# EAGLE design motherboard_rev1 (EAGLE 6.5.0)
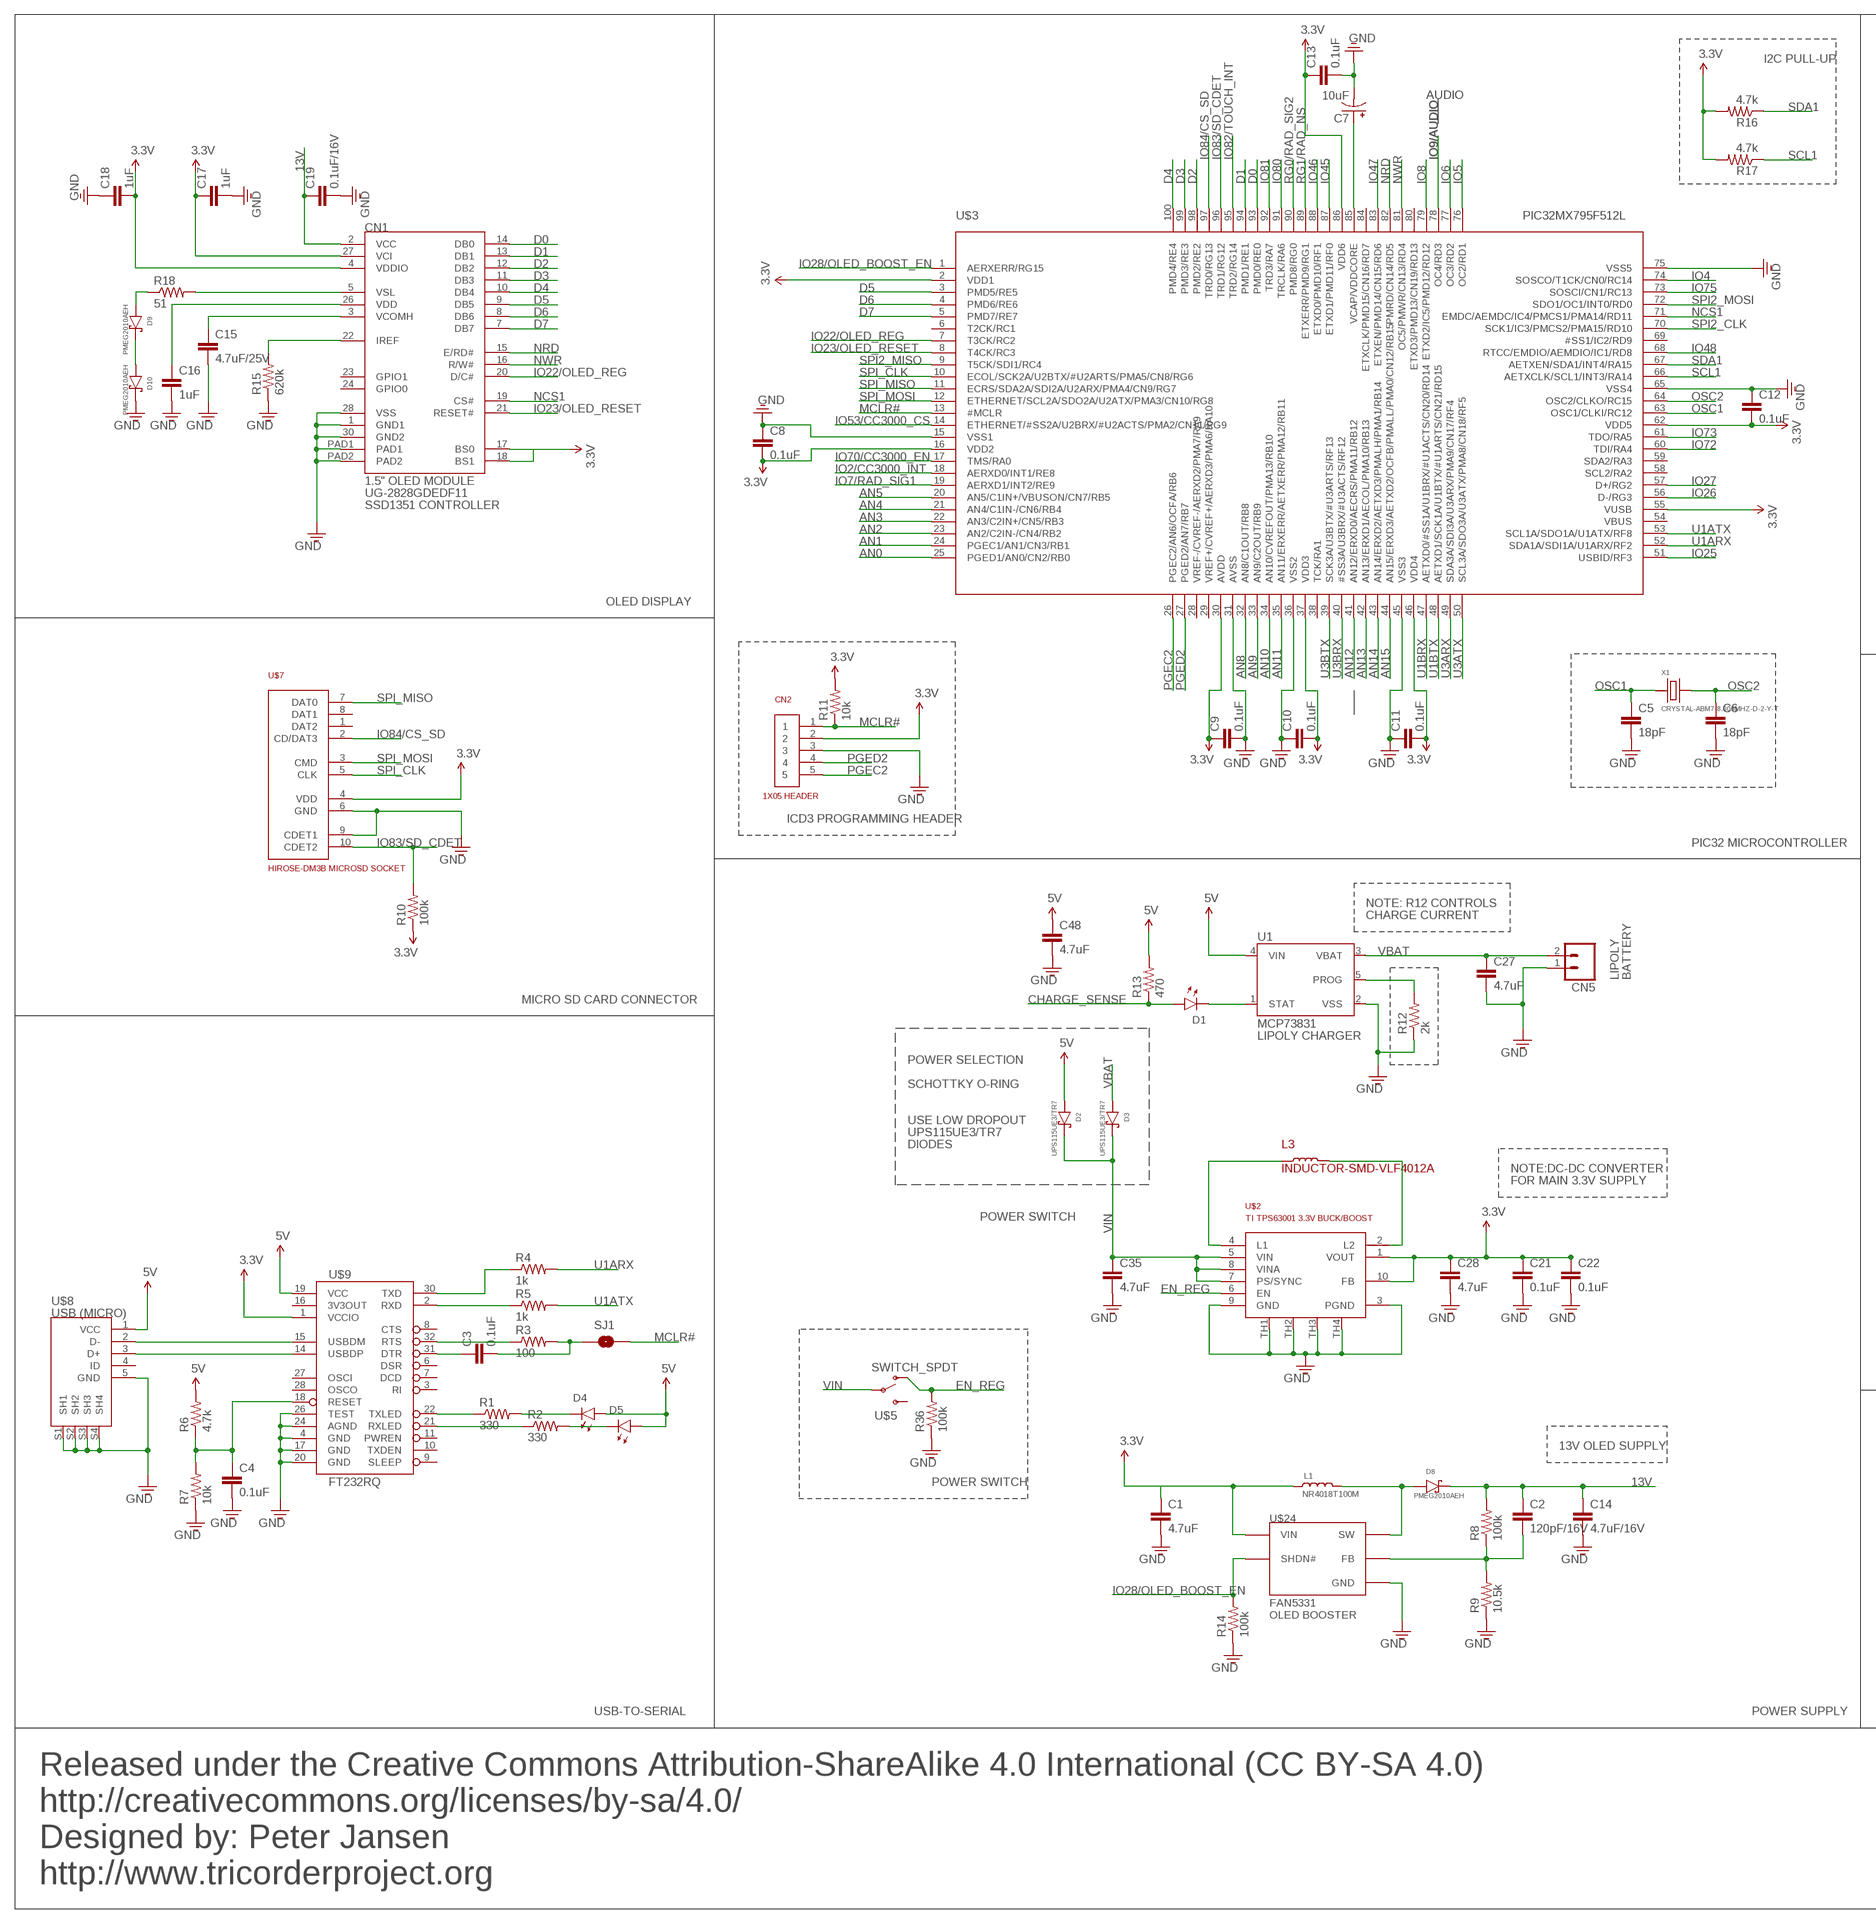
[diagram p0: schematic, sheet 1, part 1 of 2]
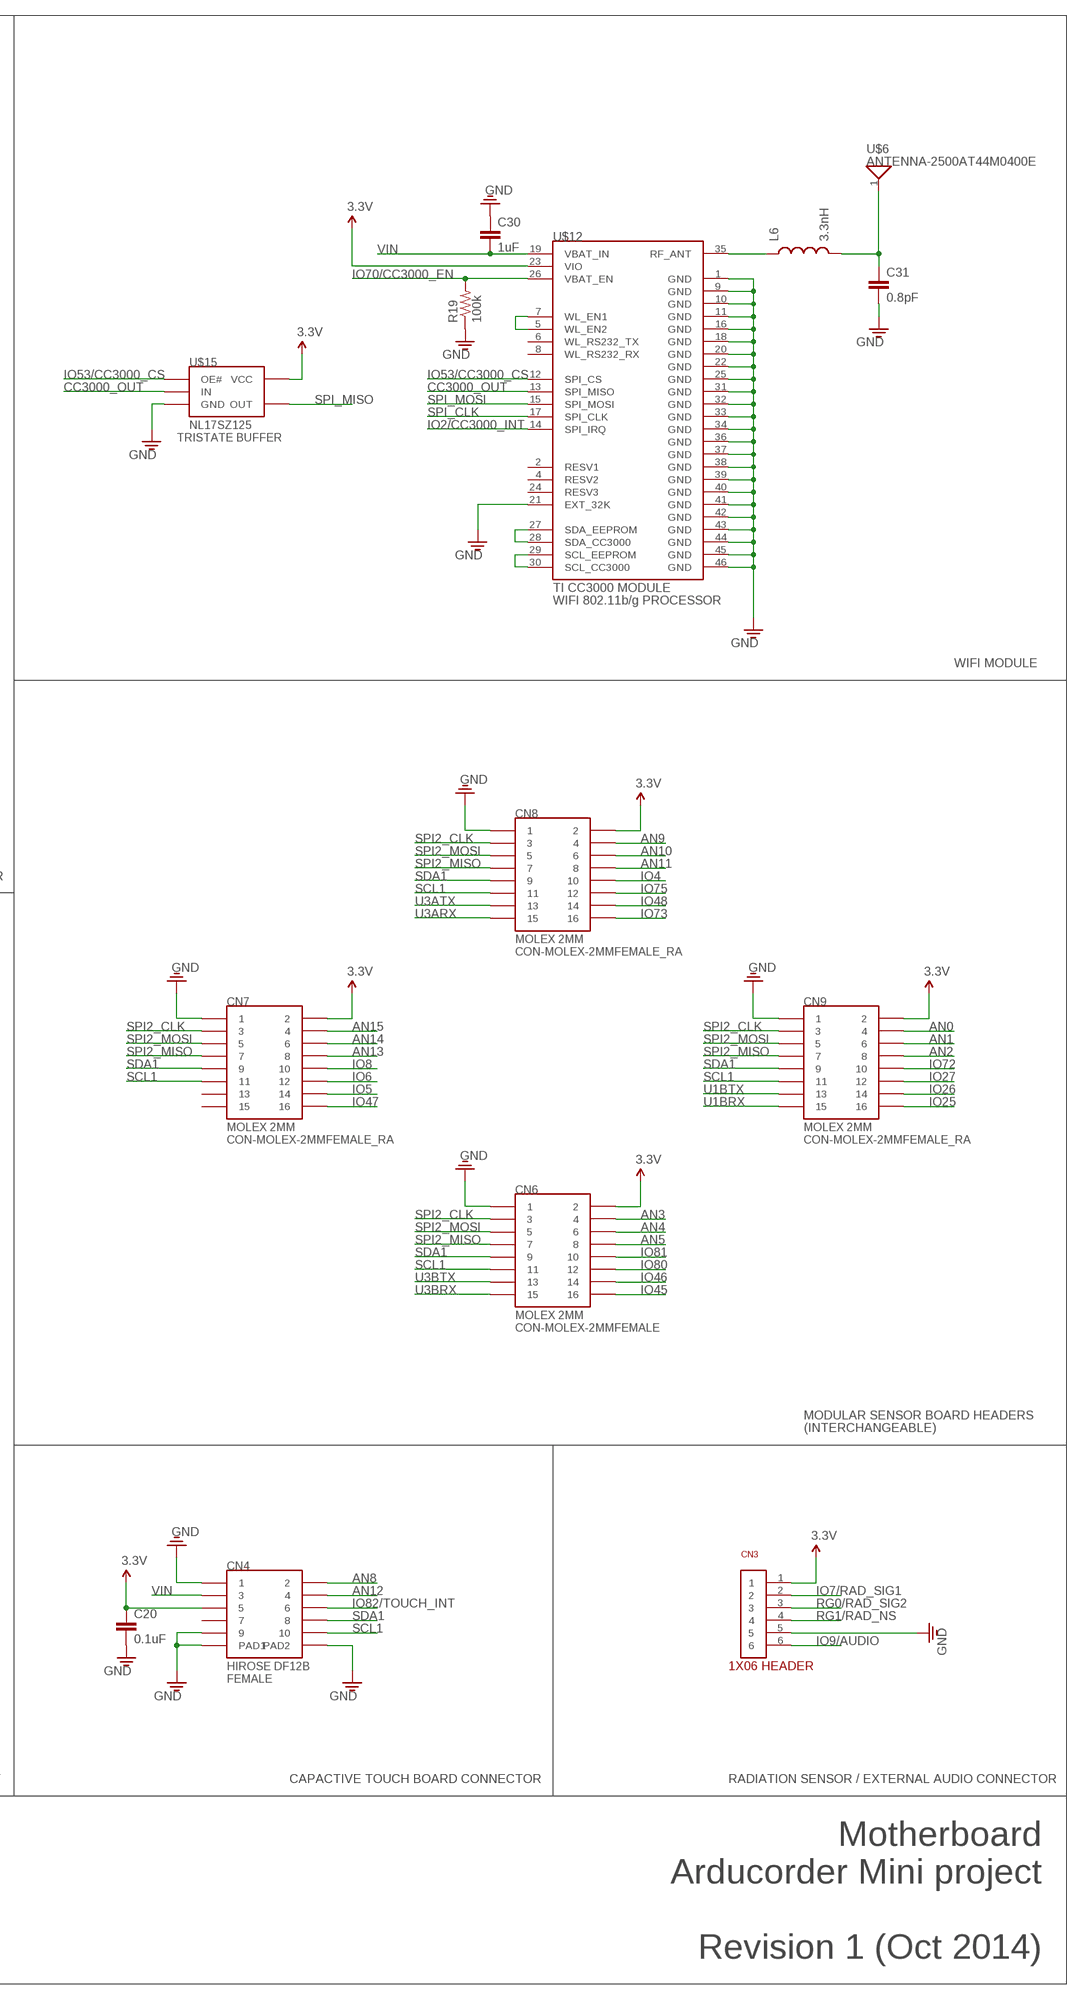
[diagram p1: schematic, sheet 1, part 2 of 2]

## Parts
C1  4.7uF  CAP0603  [0603]
C2  120pF/16V  CAP0603  [0603]
C3  0.1uF  CAP0603  [0603]
C4  0.1uF  CAP0603  [0603]
C5  18pF  CAP0603  [0603]
C6  18pF  CAP0603  [0603]
C7  10uF  CAP_POL1206  [EIA3216]
C8  0.1uF  CAP0603  [0603]
C9  0.1uF  CAP0603  [0603]
C10  0.1uF  CAP0603  [0603]
C11  0.1uF  CAP0603  [0603]
C12  0.1uF  CAP0603  [0603]
C13  0.1uF  CAP0603  [0603]
C14  4.7uF/16V  CAP0603  [0603]
C15  4.7uF/25V  CAP0603  [0603]
C16  1uF  CAP0603  [0603]
C17  1uF  CAP0603  [0603]
C18  1uF  CAP0603  [0603]
C19  0.1uF/16V  CAP0603  [0603]
C20  0.1uF  CAP0603  [0603]
C21  0.1uF  CAP0603  [0603]
C22  0.1uF  CAP0603  [0603]
C27  4.7uF  CAP0603  [0603]
C28  4.7uF  CAP0603  [0603]
C30  1uF  CAP0603  [0603]
C31  0.8pF  CAP0402  [C0402]
C35  4.7uF  CAP0603  [0603]
C48  4.7uF  CAP0603  [0603]
CN1  UG-2828GDEDF11-1.5OLED  [XF2M-3015-1A-1.5LCD]
CN2  1X05  [1X05]
CN3  PHF-106-01-L-S  1X06  [1X06]
CN4  FEMALE  CON-HIROSE-DF12FEMALE  [DF12B(3.0)-10DP-0.5V(86)]
CN5  M02-JST-2MM-SMT  [JST-2-SMD]
CN6  CON-MOLEX-2MMFEMALE  [MOLEX-0791091007]
CN7  CON-MOLEX-2MMFEMALE_RA  [MOLEX-87368-1624]
CN8  CON-MOLEX-2MMFEMALE_RA  [MOLEX-87368-1624]
CN9  CON-MOLEX-2MMFEMALE_RA  [MOLEX-87368-1624]
D1  0605-LED  [0603-LED]
D2  UPS115UE3/TR7  DIODE-SCHOTTKY  [DO-214BA]
D3  UPS115UE3/TR7  DIODE-SCHOTTKY  [DO-214BA]
D4  0605-LED  [0603-LED]
D5  0605-LED  [0603-LED]
D8  PMEG2010AEH  DIODE-SCHOTTKYSOD123F  [SOD123F]
D9  PMEG2010AEH  DIODE-SCHOTTKYSOD123F  [SOD123F]
D10  PMEG2010AEH  DIODE-SCHOTTKYSOD123F  [SOD123F]
L1  NR4018T100M  INDUCTORNR4018T100M  [NR4018T100M]
L3  INDUCTOR-SMD-VLF4012A  [VLF4012A]
L6  3.3nH  INDUCTOR0402  [C0402]
R1  330  RESISTOR0603  [0603]
R2  330  RESISTOR0603  [0603]
R3  100  RESISTOR0603  [0603]
R4  1k  RESISTOR0603  [0603]
R5  1k  RESISTOR0603  [0603]
R6  4.7k  RESISTOR0603  [0603]
R7  10k  RESISTOR0603  [0603]
R8  100k  RESISTOR0603  [0603]
R9  10.5k  RESISTOR0603  [0603]
R10  100k  RESISTOR0603  [0603]
R11  10k  RESISTOR0603  [0603]
R12  2k  RESISTOR0603  [0603]
R13  470  RESISTOR0603  [0603]
R14  100k  RESISTOR0603  [0603]
R15  620k  RESISTOR0603  [0603]
R16  4.7k  RESISTOR0603  [0603]
R17  4.7k  RESISTOR0603  [0603]
R18  51  RESISTOR0603  [0603]
R19  100k  RESISTOR0603  [0603]
R36  100k  RESISTOR0603  [0603]
SJ1  SOLDERJUMPERTRACE  [SJ_2S-TRACE]
U1  MCP73831  [SOT23-5]
U$2  TI-TPS63001-3.3V-BUCKBOOST  [TPS63001]
U$3  PIC32MX795F512L-80I/PF  [SQFP-S-14X14-100]
U$5  SWITCH_SPDT  [KPS-1290]
U$6  ANTENNA-2500AT44M0400E  [ANT-2500AT44M0400E]
U$7  CON-HIROSE-DM3B-MICROSD  [CON-HIROSE-DM3B-MICROSD]
U$8  USB-MICROB  [FCI-10104110-0001LF]
U$9  FT232RQ  [QFN-32]
U$12  CC3000  [CC3000]
U$15  BUFFER-NL17SZ125  [TSOP-5]
U$24  FAN5331-BOOST  [TSOP-5]
X1  CRYSTAL-ABM7-8.000MHZ-D-2-Y-T  [CYRSTAL-6.0X3.5MM]

## Nets
3.3V: C1.1 C8.2 C9.1 C10.2 C11.2 C12.2 C13.1 C17.1 C18.2 C20.1 C21.1 C22.1 C28.1 CN1.4(VDDIO) CN1.17(BS0) CN1.18(BS1) CN1.27(VCI) CN2.2 CN3.1 CN4.5 CN6.2 CN7.2 CN8.2 CN9.2 L1.2 R10.1 R11.2 R16.2 R17.2 U$2.1(VOUT) U$2.10(FB) U$3.2(VDD1) U$3.16(VDD2) U$3.30(AVDD) U$3.37(VDD3) U$3.46(VDD4) U$3.55(VUSB) U$3.62(VDD5) U$3.86(VDD6) U$7.4(VDD) U$9.1(VCCIO) U$12.23(VIO) U$15.5(VCC) U$24.5(VIN)
5V: C48.1 D2.ANODE D4.ANODE D5.ANODE R6.2 R13.2 U1.4(VIN) U$8.1(VCC) U$9.19(VCC)
13V: C2.1 C14.1 C19.1 CN1.2(VCC) D8.1(CATHODE) R8.2
AN0: CN9.4 U$3.25(PGED1/AN0/CN2/RB0)
AN1: CN9.6 U$3.24(PGEC1/AN1/CN3/RB1)
AN2: CN9.8 U$3.23(AN2/C2IN-/CN4/RB2)
AN3: CN6.4 U$3.22(AN3/C2IN+/CN5/RB3)
AN4: CN6.6 U$3.21(AN4/C1IN-/CN6/RB4)
AN5: CN6.8 U$3.20(AN5/C1IN+/VBUSON/CN7/RB5)
AN8: CN4.2 U$3.32(AN8/C1OUT/RB8)
AN9: CN8.4 U$3.33(AN9/C2OUT/RB9)
AN10: CN8.6 U$3.34(AN10/CVREFOUT/PMA13/RB10)
AN11: CN8.8 U$3.35(AN11/ERXERR/AETXERR/PMA12/RB11)
AN12: CN4.4 U$3.41(AN12/ERXD0/AECRS/PMA11/RB12)
AN13: CN7.8 U$3.42(AN13/ERXD1/AECOL/PMA10/RB13)
AN14: CN7.6 U$3.43(AN14/ERXD2/AETXD3/PMALH/PMA1/RB14)
AN15: CN7.4 U$3.44(AN15/ERXD3/AETXD2/OCFB/PMALL/PMA0/CN12/RB15)
CC3000_OUT: U$12.13(SPI_MISO) U$15.2(IN)
CHARGE_SENSE: D1.ANODE R13.1
D0: CN1.14(DB0) U$3.93(PMD0/RE0)
D1: CN1.13(DB1) U$3.94(PMD1/RE1)
D2: CN1.12(DB2) U$3.98(PMD2/RE2)
D3: CN1.11(DB3) U$3.99(PMD3/RE3)
D4: CN1.10(DB4) U$3.100(PMD4/RE4)
D5: CN1.9(DB5) U$3.3(PMD5/RE5)
D6: CN1.8(DB6) U$3.4(PMD6/RE6)
D7: CN1.7(DB7) U$3.5(PMD7/RE7)
EN_REG: R36.2 U$2.6(EN) U$5.O
GND: C1.2 C4.2 C5.2 C6.2 C7.C(-) C8.1 C9.2 C10.1 C11.1 C12.1 C13.2 C14.2 C15.2 C16.2 C17.2 C18.1 C19.2 C20.2 C21.2 C22.2 C27.2 C28.2 C30.1 C31.2 C35.2 C48.2 CN1.1(GND1) CN1.28(VSS) CN1.30(GND2) CN1.PAD1 CN1.PAD2 CN2.3 CN3.5 CN4.1 CN4.9 CN4.PAD1 CN4.PAD2 CN5.1 CN6.1 CN7.1 CN8.1 CN9.1 D10.1(CATHODE) R7.1 R9.1 R12.1 R14.1 R15.1 R19.1 R36.1 U1.2(VSS) U$2.3(PGND) U$2.9(GND) U$2.TH1(THERM1) U$2.TH2(THERM2) U$2.TH3(THERM3) U$2.TH4(THERM4) U$3.15(VSS1) U$3.31(AVSS) U$3.36(VSS2) U$3.45(VSS3) U$3.65(VSS4) U$3.75(VSS5) U$7.6(GND) U$7.9(CDET1) U$8.5(GND) U$8.S1(SH1) U$8.S2(SH2) U$8.S3(SH3) U$8.S4(SH4) U$9.4(GND) U$9.17(GND) U$9.20(GND) U$9.24(AGND) U$9.26(TEST) U$12.1(GND) U$12.9(GND) U$12.10(GND) U$12.11(GND) U$12.16(GND) U$12.18(GND) U$12.20(GND) U$12.21(EXT_32K) U$12.22(GND) U$12.25(GND) U$12.31(GND) U$12.32(GND) U$12.33(GND) U$12.34(GND) U$12.36(GND) U$12.37(GND) U$12.38(GND) U$12.39(GND) U$12.40(GND) U$12.41(GND) U$12.42(GND) U$12.43(GND) U$12.44(GND) U$12.45(GND) U$12.46(GND) U$15.3(GND) U$24.2(GND)
IO2/CC3000_INT: U$3.18(AERXD0/INT1/RE8) U$12.14(SPI_IRQ)
IO4: CN8.10 U$3.74(SOSCO/T1CK/CN0/RC14)
IO5: CN7.14 U$3.76(OC2/RD1)
IO6: CN7.12 U$3.77(OC3/RD2)
IO7/RAD_SIG1: CN3.2 U$3.19(AERXD1/INT2/RE9)
IO8: CN7.10 U$3.79(ETXD2/IC5/PMD12/RD12)
IO9/AUDIO: CN3.6 U$3.78(OC4/RD3)
IO22/OLED_REG: CN1.20(D/C#) U$3.7(T3CK/RC2)
IO23/OLED_RESET: CN1.21(RESET#) U$3.8(T4CK/RC3)
IO25: CN9.16 U$3.51(USBID/RF3)
IO26: CN9.14 U$3.56(D-/RG3)
IO27: CN9.12 U$3.57(D+/RG2)
IO28/OLED_BOOST_EN: R14.2 U$3.1(AERXERR/RG15) U$24.4(SHDN#)
IO45: CN6.16 U$3.87(ETXD1/PMD11/RF0)
IO46: CN6.14 U$3.88(ETXD0/PMD10/RF1)
IO47: CN7.16 U$3.83(ETXEN/PMD14/CN15/RD6)
IO48: CN8.14 U$3.68(RTCC/EMDIO/AEMDIO/IC1/RD8)
IO53/CC3000_CS: U$3.14(ETHERNET/#SS2A/U2BRX/#U2ACTS/PMA2/CN11/RG9) U$12.12(SPI_CS) U$15.1(OE#)
IO70/CC3000_EN: R19.2 U$3.17(TMS/RA0) U$12.26(VBAT_EN)
IO72: CN9.10 U$3.60(TDI/RA4)
IO73: CN8.16 U$3.61(TDO/RA5)
IO75: CN8.12 U$3.73(SOSCI/CN1/RC13)
IO80: CN6.12 U$3.91(TRCLK/RA6)
IO81: CN6.10 U$3.92(TRD3/RA7)
IO82/TOUCH_INT: CN4.6 U$3.95(TRD2/RG14)
IO83/SD_CDET: R10.2 U$3.96(TRD1/RG12) U$7.10(CDET2)
IO84/CS_SD: U$3.97(TRD0/RG13) U$7.2(CD/DAT3)
MCLR#: CN2.1 R11.1 SJ1.2 U$3.13(#MCLR)
N$1: L3.1 U$2.4(L1)
N$2: L3.2 U$2.2(L2)
N$3: U$8.2(D-) U$9.15(USBDM)
N$4: U$8.3(D+) U$9.14(USBDP)
N$5: R1.1 U$9.22(TXLED)
N$6: R2.1 U$9.21(RXLED)
N$7: D4.CATHODE R1.2
N$8: D5.CATHODE R2.2
N$9: C3.1 U$9.31(DTR)
N$10: R3.1 U$9.32(RTS)
N$11: C3.2 R3.2 SJ1.1
N$12: C4.1 R6.1 R7.2 U$9.18(RESET)
N$13: R5.1 U$9.2(RXD)
N$14: C31.1 L6.2 U$6.1
N$15: R4.1 U$9.30(TXD)
N$16: U$12.27(SDA_EEPROM) U$12.28(SDA_CC3000)
N$18: L6.1 U$12.35(RF_ANT)
N$19: C7.A(+) U$3.85(VCAP/VDDCORE)
N$20: C15.1 CN1.3(VCOMH)
N$21: D8.2(ANODE) L1.1 U$24.1(SW)
N$22: CN1.22(IREF) R15.2
N$23: C2.2 R8.1 R9.2 U$24.3(FB)
N$24: C16.1 CN1.26(VDD)
N$25: D9.1(CATHODE) D10.2(ANODE)
N$26: D9.2(ANODE) R18.1
N$27: R12.2 U1.5(PROG)
N$28: U$12.29(SCL_EEPROM) U$12.30(SCL_CC3000)
N$29: CN1.5(VSL) R18.2
N$32: D1.CATHODE U1.1(STAT)
N$33: U$12.5(WL_EN2) U$12.7(WL_EN1)
NCS1: CN1.19(CS#) U$3.71(EMDC/AEMDC/IC4/PMCS1/PMA14/RD11)
NRD: CN1.15(E/RD#) U$3.82(PMRD/CN14/RD5)
NWR: CN1.16(R/W#) U$3.81(OC5/PMWR/CN13/RD4)
OSC1: C5.1 U$3.63(OSC1/CLKI/RC12) X1.1
OSC2: C6.1 U$3.64(OSC2/CLKO/RC15) X1.2
PGEC2: CN2.5 U$3.26(PGEC2/AN6/OCFA/RB6)
PGED2: CN2.4 U$3.27(PGED2/AN7/RB7)
RG0/RAD_SIG2: CN3.3 U$3.90(PMD8/RG0)
RG1/RAD_NS: CN3.4 U$3.89(ETXERR/PMD9/RG1)
SCL1: CN4.10 CN6.11 CN7.11 CN8.11 CN9.11 R17.1 U$3.66(AETXCLK/SCL1/INT3/RA14)
SDA1: CN4.8 CN6.9 CN7.9 CN8.9 CN9.9 R16.1 U$3.67(AETXEN/SDA1/INT4/RA15)
SPI2_CLK: CN6.3 CN7.3 CN8.3 CN9.3 U$3.70(SCK1/IC3/PMCS2/PMA15/RD10)
SPI2_MISO: CN6.7 CN7.7 CN8.7 CN9.7 U$3.9(T5CK/SDI1/RC4)
SPI2_MOSI: CN6.5 CN7.5 CN8.5 CN9.5 U$3.72(SDO1/OC1/INT0/RD0)
SPI_CLK: U$3.10(ECOL/SCK2A/U2BTX/#U2ARTS/PMA5/CN8/RG6) U$7.5(CLK) U$12.17(SPI_CLK)
SPI_MISO: U$3.11(ECRS/SDA2A/SDI2A/U2ARX/PMA4/CN9/RG7) U$7.7(DAT0) U$15.4(OUT)
SPI_MOSI: U$3.12(ETHERNET/SCL2A/SDO2A/U2ATX/PMA3/CN10/RG8) U$7.3(CMD) U$12.15(SPI_MOSI)
U1ARX: R4.2 U$3.52(SDA1A/SDI1A/U1ARX/RF2)
U1ATX: R5.2 U$3.53(SCL1A/SDO1A/U1ATX/RF8)
U1BRX: CN9.15 U$3.47(AETXD0/#SS1A/U1BRX/#U1ACTS/CN20/RD14)
U1BTX: CN9.13 U$3.48(AETXD1/SCK1A/U1BTX/#U1ARTS/CN21/RD15)
U3ARX: CN8.15 U$3.49(SDA3A/SDI3A/U3ARX/PMA9/CN17/RF4)
U3ATX: CN8.13 U$3.50(SCL3A/SDO3A/U3ATX/PMA8/CN18/RF5)
U3BRX: CN6.15 U$3.40(#SS3A/U3BRX/#U3ACTS/RF12)
U3BTX: CN6.13 U$3.39(SCK3A/U3BTX/#U3ARTS/RF13)
VBAT: C27.1 CN5.2 D3.ANODE U1.3(VBAT)
VIN: C30.2 C35.1 CN4.3 D2.CATHODE D3.CATHODE U$2.5(VIN) U$2.7(PS/SYNC) U$2.8(VINA) U$5.P U$12.19(VBAT_IN)
Unconnected: CN1.23(GPIO1) CN1.24(GPIO0) CN4.7 CN7.13 CN7.15 U$3.6(T2CK/RC1) U$3.28(VREF-/CVREF-/AERXD2/PMA7/RA9) U$3.29(VREF+/CVREF+/AERXD3/PMA6/RA10) U$3.38(TCK/RA1) U$3.54(VBUS) U$3.58(SCL2/RA2) U$3.59(SDA2/RA3) U$3.69(#SS1/IC2/RD9) U$3.80(ETXD3/PMD13/CN19/RD13) U$3.84(ETXCLK/PMD15/CN16/RD7) U$5.S U$7.1(DAT2) U$7.8(DAT1) U$8.4(ID) U$9.3(RI) U$9.6(DSR) U$9.7(DCD) U$9.8(CTS) U$9.9(SLEEP) U$9.10(TXDEN) U$9.11(PWREN) U$9.16(3V3OUT) U$9.27(OSCI) U$9.28(OSCO) U$12.2(RESV1) U$12.4(RESV2) U$12.6(WL_RS232_TX) U$12.8(WL_RS232_RX) U$12.24(RESV3)

## Notes on the sheet
- I2C PULL-UP
- AUDIO
- OLED DISPLAY
- WIFI MODULE
- ICD3 PROGRAMMING HEADER
- PIC32 MICROCONTROLLER
- NOTE: R12 CONTROLS
- CHARGE CURRENT
- LIPOLY | BATTERY
- MICRO SD CARD CONNECTOR
- LIPOLY CHARGER
- POWER SELECTION
- SCHOTTKY O-RING
- USE LOW DROPOUT
- UPS115UE3/TR7
- DIODES
- NOTE:DC-DC CONVERTER
- FOR MAIN 3.3V SUPPLY
- POWER SWITCH
- MODULAR SENSOR BOARD HEADERS
- (INTERCHANGEABLE)
- 13V OLED SUPPLY
- POWER SWITCH
- USB-TO-SERIAL | POWER SUPPLY | CAPACTIVE TOUCH BOARD CONNECTOR | RADIATION SENSOR / EXTERNAL AUDIO CONNECTOR
- Motherboard
- Released under the Creative Commons Attribution-ShareAlike 4.0 International (CC BY-SA 4.0)
- Arducorder Mini project
- http://creativecommons.org/licenses/by-sa/4.0/
- Designed by: Peter Jansen
- Revision 1 (Oct 2014)
- http://www.tricorderproject.org

## Library data of the parts
C1 C3-C6 C8-C22 C27 C28 C30 C31 C35 C48 = notes_mark5a:CAP: Capacitor Standard 0603 ceramic capacitor, and 0.1" leaded capacitor.
C2 = notes_mark5a1:CAP: Capacitor Standard 0603 ceramic capacitor, and 0.1" leaded capacitor.
C7 = SparkFun-Passives:CAP_POL: Capacitor Polarized These are standard SMD and PTH capacitors. Normally 10uF, 47uF, and 100uF in electrolytic and tantalum varieties. Always verify the external diameter of the through hole cap, it varies with capacity, voltage, and manufacturer. The EIA devices should be standard.
CN1 = notes-arducorder-mini:UG-2828GDEDF11-1.5OLED: OLED display, 1.5", 128x128, 16bpp. Model #ER-OLED015 or UG-2828GDEDF11
CN2 = notes_mark5a:1X05
CN3 = arm1a:1X06
CN4 = notes-arducorder-mini:CON-HIROSE-DF12
CN5 = SparkFun-Connectors:M02: Header 2 Standard 2-pin 0.1" header. Use with straight break away headers (SKU : PRT-00116), right angle break away headers (PRT-00553), swiss pins (PRT-00743), machine pins (PRT-00117), and female headers (PRT-00115). Molex polarized connector foot print use with SKU : PRT-08233 with associated crimp pins and housings.
CN6-CN9 = notes-arducorder-mini:CON-MOLEX-2MM: Molex 2mm pitch connectors. (87368-1624, 0877591650)
D1 D4 D5 = notes_mark5a:0605-LED
D2 D3 = notes_mark5a:DIODE-SCHOTTKY
D8-D10 = notes-arducorder-mini:DIODE-SCHOTTKY
L1 = notes-arducorder-mini:INDUCTOR
L3 = notes_mark5a:INDUCTOR-SMD-VLF4012A
L6 = SparkFun-Passives:INDUCTOR: Inductors Basic Inductor/Choke - 0603 and 1206. Footprints are not proven and vary greatly between part numbers.
R1-R7 R10-R13 R16 R17 R36 = notes_mark5a:RESISTOR: Resistor Basic schematic elements and footprints for 0603, 1206, and PTH 1/10th watt (small) resistors.
R8 R9 R14 R15 R18 R19 = notes_mark5a1:RESISTOR: Resistor Basic schematic elements and footprints for 0603, 1206, and PTH 1/10th watt (small) resistors.
SJ1 = SparkFun-Passives:SOLDERJUMPER: Solder Jumper Standard SMD solder jumper. Used to automate production. Two varients : Normally Open and Normally Closed are the same, but have different paste layers. NC will have a large amount of paste and should jumper during reflow.
U1 = SparkFun-PowerIC:MCP73831: Miniature single cell, fully integrated Li-Ion, Li-polymer charge management controller http://ww1.microchip.com/downloads/en/DeviceDoc/21984a.pdf
U$2 = notes_mark5a:TI-TPS63001-3.3V-BUCKBOOST: Texas Instruments TPS63001 3.3V Buck/Boost DC-DC Converter. High efficiency, single inductor.
U$3 = notes_mark5:PIC32MX795F512L-80I/PF
U$5 = SparkFun-Electromechanical:SWITCH_SPDT: Side-actuated SPDT slide switch, as used on the Arduino Pro
U$6 = notes_mark5a:ANTENNA-2500AT44M0400E: WiMAX 2.7Ghz Antenna #2500AT44M0400E by Johnson Technologies. For use with TI CC3000 Wifi Module.
U$7 = arm1a:CON-HIROSE-DM3B-MICROSD
U$8 = notes_mark5a:USB-MICROB: FCI USB Micro-B Socket (Part# 10104110-0001LF)
U$9 = SparkFun-DigitalIC:FT232RQ: USB to USART. Non-stock item, unproven FP for this part.
U$12 = notes_mark5a:CC3000: Texas Instruments SimpleLink CC3000 Module -- Wi-Fi 802.11b/g Network Processor
U$15 = notes-arducorder-mini:BUFFER-NL17SZ125: ON Semi NL17SZ125 Non-inverting 3-state buffer
U$24 = notes-arducorder-mini:FAN5331-BOOST: Fairchild FAN5331 High-efficiency OLED Supply
X1 = notes_mark5a:CRYSTAL-ABM7-8.000MHZ-D-2-Y-T

## Board
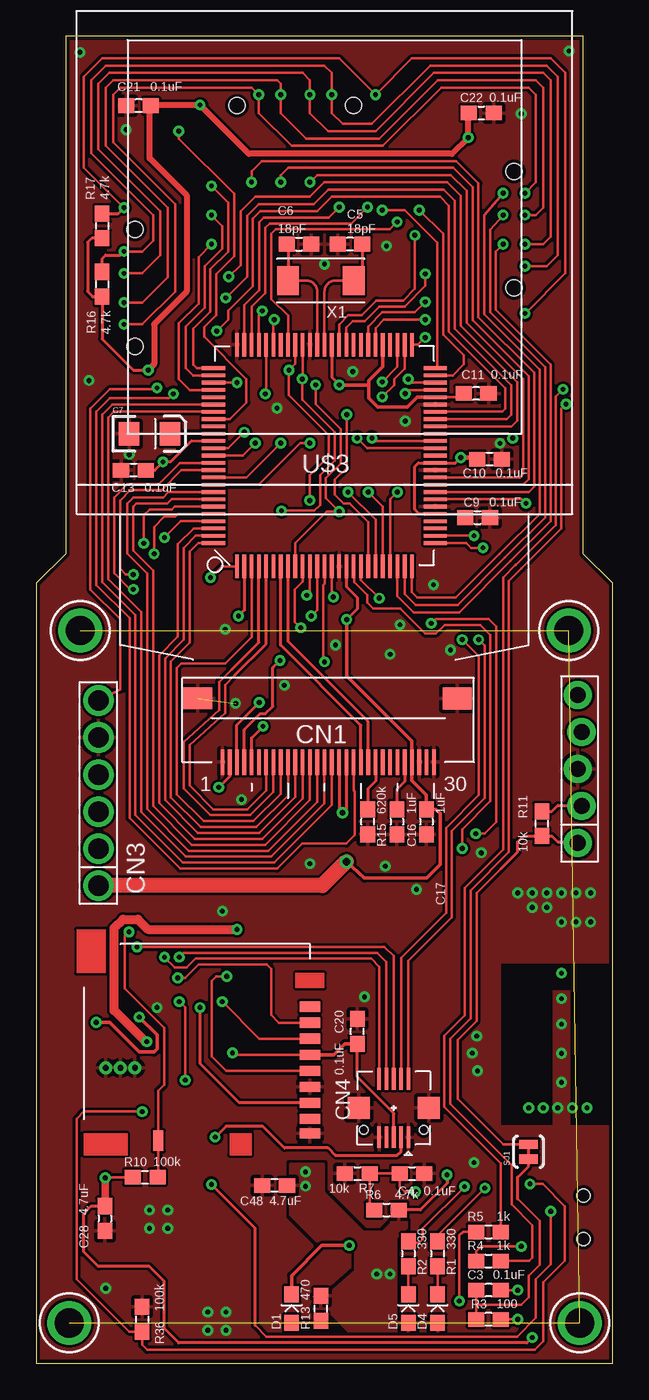
[diagram p2: board, top side]
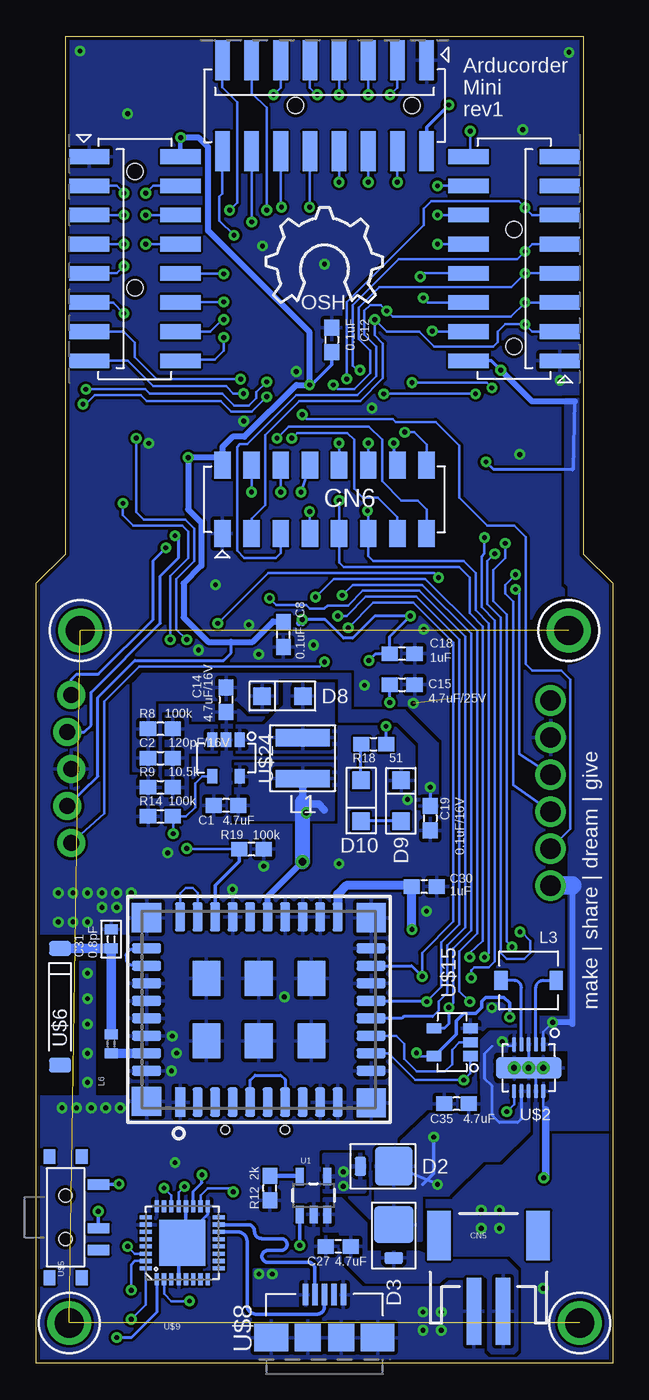
[diagram p3: board, bottom side, seen from below]

Size 39.5 x 91 mm. Coordinates in mm from the lower left corner, seen from the top.
Outline: 0,0 39.5,0 39.5,53.5 37.5,55.5 37.5,91 2,91 2,55.5 0,53.5 0,0
Copper layers (1*16): Top 0.035mm / dielectric 1.5mm / Bottom 0.035mm
Design rules "default *": minimum track width 7mil, minimum drill 13mil, track to track 7mil, track to pad 7mil, pad to pad 7mil, via to via 7mil, smd to smd 7mil, copper to edge 10mil, drill to drill 8mil, minimum pad ring 10mil, minimum via ring 8mil, stop-mask expansion 4mil, vias tented up to drill 0mil, thermal gap 10mil
tKeepout: area 4.8,21.8 to 20.2,34.8
bKeepout: area 2.8,15.2 to 10.8,21.2
bRestrict: area 1,48 to 5.5,52.5

### Footprints (pad centres in the part's own frame; a part is rotated, then mirrored left to right if it is on the bottom)
0603 = smd 1.1 x 1: 1 -0.85,0; 2 0.85,0
EIA3216 = smd 1.4 x 1.6: A 1.4,0; C -1.4,0
C0402 = smd 0.7 x 0.9: 1 -0.65,0; 2 0.65,0
XF2M-3015-1A-1.5LCD = smd 0.25 x 1.75: 1 -7,-3.02; 2 -6.5,-3.02; 3 -6,-3.02; 4 -5.5,-3.02; 5 -5,-3.02; 6 -4.5,-3.02; 7 -4,-3.02; 8 -3.5,-3.02; 9 -3,-3.02; 10 -2.5,-3.02; 11 -2,-3.02; 12 -1.5,-3.02; 13 -1,-3.02; 14 -0.5,-3.02; 15 0,-3.02; 16 0.5,-3.02; 17 1,-3.02; 18 1.5,-3.02; 19 2,-3.02; 20 2.5,-3.02; 21 3,-3.02; 22 3.5,-3.02; 23 4,-3.02; 24 4.5,-3.02; 25 5,-3.02; 26 5.5,-3.02; 27 6,-3.02; 28 6.5,-3.02; 29 7,-3.02; 30 7.5,-3.02 | smd 2 x 1.5: PAD1 9.11,1.34; PAD2 -8.68,1.35
1X05 = drill 1.1 pad 1.93: 1 -5.08,0.127; 2 -2.54,-0.127; 3 0,0.127; 4 2.54,-0.127; 5 5.08,0.127
1X06 = drill 1.4: 1 0,0; 2 2.54,0; 3 5.08,0; 4 7.62,0; 5 10.16,0; 6 12.7,0
DF12B(3.0)-10DP-0.5V(86) = smd 0.25 x 1.5: 1 -1,2; 2 -1,-2; 3 -0.5,2; 4 -0.5,-2; 5 0,2; 6 0,-2; 7 0.5,2; 8 0.5,-2; 9 1,2; 10 1,-2 | smd 1.5 x 1.5: PAD1 -2.4,0; PAD2 2.4,0 | hole 0.6: -2.05,1.5; 2.05,1.5
JST-2-SMD = smd 1 x 4.6: 1 -1,-3.7; 2 1,-3.7 | smd 1.6 x 3.4: NC1 -3.4,1.5; NC2 3.4,1.5
MOLEX-0791091007 = smd 1.12 x 1.83: 1 7,2.35; 2 7,-2.35; 3 5,2.35; 4 5,-2.35; 5 3,2.35; 6 3,-2.35; 7 1,2.35; 8 1,-2.35; 9 -1,2.35; 10 -1,-2.35; 11 -3,2.35; 12 -3,-2.35; 13 -5,2.35; 14 -5,-2.35; 15 -7,2.35; 16 -7,-2.35
MOLEX-87368-1624 = smd 1 x 2.75: 1 7,3.125; 2 7,-3.125; 3 5,3.125; 4 5,-3.125; 5 3,3.125; 6 3,-3.125; 7 1,3.125; 8 1,-3.125; 9 -1,3.125; 10 -1,-3.125; 11 -3,3.125; 12 -3,-3.125; 13 -5,3.125; 14 -5,-3.125; 15 -7,3.125; 16 -7,-3.125 | hole 1.1: -2,0; 6,0
0603-LED = smd 1.1 x 1: ANODE -0.975,0; CATHODE 0.975,0
DO-214BA = smd 0.762 x 1.27: ANODE 2.286,0 | smd 2.54 x 2.667: CATHODE 0,0
SOD123F = smd 1.2 x 1.2: 1 1.4,0; 2 -1.4,0
NR4018T100M = smd 1.2 x 3.7: 1 -1.4,0; 2 1.4,0
VLF4012A = smd 0.9 x 1.3: 1 -1.9,0; 2 1.9,0
SJ_2S-TRACE = smd 0.635 x 1.27: 1 -0.508,0; 2 0.508,0
SOT23-5 = smd 0.55 x 1.2: 1 -0.95,-1.3; 2 0,-1.3; 3 0.95,-1.3; 4 0.95,1.3; 5 -0.95,1.3
TPS63001 = smd 0.3 x 1: 1 -1,-1.6; 2 -0.5,-1.6; 3 0,-1.6; 4 0.5,-1.6; 5 1,-1.6; 6 1,1.6; 7 0.5,1.6; 8 0,1.6; 9 -0.5,1.6; 10 -1,1.6 | drill 0.381: TH1 0,0; TH2 1,0; TH3 -1,0 | smd 4.5 x 1.5: TH4 0,0
SQFP-S-14X14-100 = smd 0.25 x 1.6: 1 -6,-7.6; 2 -5.5,-7.6; 3 -5,-7.6; 4 -4.5,-7.6; 5 -4,-7.6; 6 -3.5,-7.6; 7 -3,-7.6; 8 -2.5,-7.6; 9 -2,-7.6; 10 -1.5,-7.6; 11 -1,-7.6; 12 -0.5,-7.6; 13 0,-7.6; 14 0.5,-7.6; 15 1,-7.6; 16 1.5,-7.6; 17 2,-7.6; 18 2.5,-7.6; 19 3,-7.6; 20 3.5,-7.6; 21 4,-7.6; 22 4.5,-7.6; 23 5,-7.6; 24 5.5,-7.6; 25 6,-7.6; 51 6,7.6; 52 5.5,7.6; 53 5,7.6; 54 4.5,7.6; 55 4,7.6; 56 3.5,7.6; 57 3,7.6; 58 2.5,7.6; 59 2,7.6; 60 1.5,7.6; 61 1,7.6; 62 0.5,7.6; 63 0,7.6; 64 -0.5,7.6; 65 -1,7.6; 66 -1.5,7.6; 67 -2,7.6; 68 -2.5,7.6; 69 -3,7.6; 70 -3.5,7.6; 71 -4,7.6; 72 -4.5,7.6; 73 -5,7.6; 74 -5.5,7.6; 75 -6,7.6 | smd 1.6 x 0.25: 26 7.6,-6; 27 7.6,-5.5; 28 7.6,-5; 29 7.6,-4.5; 30 7.6,-4; 31 7.6,-3.5; 32 7.6,-3; 33 7.6,-2.5; 34 7.6,-2; 35 7.6,-1.5; 36 7.6,-1; 37 7.6,-0.5; 38 7.6,0; 39 7.6,0.5; 40 7.6,1; 41 7.6,1.5; 42 7.6,2; 43 7.6,2.5; 44 7.6,3; 45 7.6,3.5; 46 7.6,4; 47 7.6,4.5; 48 7.6,5; 49 7.6,5.5; 50 7.6,6; 76 -7.6,6; 77 -7.6,5.5; 78 -7.6,5; 79 -7.6,4.5; 80 -7.6,4; 81 -7.6,3.5; 82 -7.6,3; 83 -7.6,2.5; 84 -7.6,2; 85 -7.6,1.5; 86 -7.6,1; 87 -7.6,0.5; 88 -7.6,0; 89 -7.6,-0.5; 90 -7.6,-1; 91 -7.6,-1.5; 92 -7.6,-2; 93 -7.6,-2.5; 94 -7.6,-3; 95 -7.6,-3.5; 96 -7.6,-4; 97 -7.6,-4.5; 98 -7.6,-5; 99 -7.6,-5.5; 100 -7.6,-6
KPS-1290 = smd 0.7 x 1.5: O -2.25,2.25; P 0.75,2.25; S 2.25,2.25 | smd 1 x 0.8: P$1 -4.15,1.1; P$2 -4.15,-1.1; P$3 4.15,-1.1; P$4 4.15,1.1 | hole 0.9: -1.5,0; 1.5,0
ANT-2500AT44M0400E = smd 1 x 1.5: 1 4,0; 2 -4,0
CON-HIROSE-DM3B-MICROSD = smd 0.7 x 1.4: 1 -7.7,0; 2 -6.6,0; 3 -5.5,0; 4 -4.4,0; 5 -3.3,0; 6 -2.2,0; 7 -1.1,0; 8 0,0; 9 1,0 | smd 1.4 x 0.7: 10 1.5,-10.4
FCI-10104110-0001LF = smd 0.4 x 1.5: 1 -1.3,1.95; 2 -0.65,1.95; 3 0,1.95; 4 0.65,1.95; 5 1.3,1.95 | smd 2.3 x 1.9: S1 -3.65,-1; S4 3.65,-1 | smd 1.8 x 1.9: S2 -1.15,-1; S3 1.15,-1
QFN-32 = smd 0.285 x 0.8: 1 -1.75,-2.5; 2 -1.25,-2.5; 3 -0.75,-2.5; 4 -0.25,-2.5; 5 0.25,-2.5; 6 0.75,-2.5; 7 1.25,-2.5; 8 1.75,-2.5; 17 1.75,2.5; 18 1.25,2.5; 19 0.75,2.5; 20 0.25,2.5; 21 -0.25,2.5; 22 -0.75,2.5; 23 -1.25,2.5; 24 -1.75,2.5 | smd 0.8 x 0.285: 9 2.5,-1.75; 10 2.5,-1.25; 11 2.5,-0.75; 12 2.5,-0.25; 13 2.5,0.25; 14 2.5,0.75; 15 2.5,1.25; 16 2.5,1.75; 25 -2.5,1.75; 26 -2.5,1.25; 27 -2.5,0.75; 28 -2.5,0.25; 29 -2.5,-0.25; 30 -2.5,-0.75; 31 -2.5,-1.25; 32 -2.5,-1.75 | smd 3.15 x 3.15: EP 0,0
CC3000 = smd 2 x 0.7: 1 -6.35,5.4; 2 -6.35,4.2; 3 -6.35,3; 4 -6.35,1.8; 5 -6.35,0.6; 6 -6.35,-0.6; 7 -6.35,-1.8; 8 -6.35,-3; 9 -6.35,-4.2; 10 -6.35,-5.4; 19 6.35,-5.4; 20 6.35,-4.2; 21 6.35,-3; 22 6.35,-1.8; 23 6.35,-0.6; 24 6.35,0.6; 25 6.35,1.8; 26 6.35,3; 27 6.35,4.2; 28 6.35,5.4 | smd 0.7 x 2: 11 -4.2,-7.7; 12 -3,-7.7; 13 -1.8,-7.7; 14 -0.6,-7.7; 15 0.6,-7.7; 16 1.8,-7.7; 17 3,-7.7; 18 4.2,-7.7; 29 4.2,7.7; 30 3,7.7; 31 1.8,7.7; 32 0.6,7.7; 33 -0.6,7.7; 34 -1.8,7.7; 35 -3,7.7; 36 -4.2,7.7 | smd 2.4 x 1.9: 37 -2.15,3.6; 38 -2.15,0; 39 -2.15,-3.6; 40 2.15,3.6; 41 2.15,0; 42 2.15,-3.6 | smd 2 x 2: 43 -6.3,7.7; 44 -6.4,-7.7; 45 6.3,-7.7; 46 6.3,7.7
TSOP-5 = smd 0.7 x 1: 1 0.95,1.25; 2 0,1.25; 3 -0.95,1.25; 4 -0.95,-1.25; 5 0.95,-1.25
CYRSTAL-6.0X3.5MM = smd 1.5 x 2: 1 -2.25,0; 2 2.25,0

### Placement (x,y rotation side)
C1  26.5,38.25 180 bottom
C2  31,41.5 0 bottom
C3  31,5 180 top
C4  25.75,13 0 top
C5  21.5,76.75 180 top
C6  18,76.75 0 top
C7  7.75,63.75 0 top
C8  22.56,49.97 90 bottom
C9  30.25,58 0 top
C10  31.06,62 180 top
C11  30.15,66.5 180 top
C12  19.25,70.19 270 bottom
C13  6.65,61.25 180 top
C14  26.5,45.5 270 bottom
C15  14.43,46.54 0 bottom
C16  24.72,37.12 270 top
C17  26.74,37.12 270 top
C18  14.43,48.67 180 bottom
C19  12.5,37.38 270 bottom
C20  22,22.75 90 top
C21  7,86.25 180 top
C22  30.5,85.75 0 top
C27  18.81,8 180 bottom
C28  4.69,9.92 270 top
C30  12.91,32.68 180 bottom
C31  34.38,29.09 90 bottom
C35  10.7,17.79 180 bottom
C48  16.33,12.18 180 top
CN1  19.75,44.25 0 top
CN2  37.25,40.75 90 top
CN3  4.25,32.75 90 top
CN4  24.5,17.5 180 top
CN5  8.5,7.25 0 bottom
CN6  19.75,59.25 180 bottom
CN7  6.75,75.75 270 bottom
CN8  19.75,86.25 0 bottom
CN9  32.75,75.75 90 bottom
D1  17.5,3.75 90 top
D2  15,13.5 180 bottom
D3  15,9.5 270 bottom
D4  27.5,3.75 90 top
D5  25.5,3.75 90 top
D8  22.62,45.75 180 bottom
D9  17.25,38.58 270 bottom
D10  14.5,38.58 90 bottom
L1  21.25,41.5 270 bottom
L3  5.75,26.25 0 bottom
L6  34.38,21.9 90 bottom
R1  27.5,7.5 270 top
R2  25.5,7.5 270 top
R3  31,3 180 top
R4  31,7 0 top
R5  31,9 0 top
R6  24,10.5 0 top
R7  22,13 0 top
R8  31,43.5 180 bottom
R9  31,39.5 0 bottom
R10  7.45,12.75 0 top
R11  34.65,37 90 top
R12  23.5,12 90 bottom
R13  19.5,3.75 90 top
R14  31,37.5 0 bottom
R15  22.72,37.12 90 top
R16  4.5,74 270 top
R17  4.5,78 270 top
R18  16.38,42.45 0 bottom
R19  24.75,35.25 180 bottom
R36  7.25,3 270 top
SJ1  33.75,14.5 90 top
U1  20.5,11.5 0 bottom
U$2  5.75,20.25 180 bottom
U$3  19.75,62.25 0 top
U$5  37.5,10 270 bottom
U$6  37.88,24.44 90 bottom
U$7  18.75,16.75 270 top
U$8  19.75,2.75 0 bottom
U$9  29.5,8.25 0 bottom
U$12  24.25,24.25 90 bottom
U$15  11,22 270 bottom
U$24  26.5,41.5 0 bottom
X1  19.5,74.25 180 top

### Tracks (layer width: path | path; a pad name or v marks a point on that pad's centre or on a via)
3.3V  (via drill 0.33, 0.38, 0.5)
  Top 0.178: U$3.86 10.62,63.25 | 7.41,61.25 C13.1 | U$3.46 29.4,66.25 C11.2 | U$3.30 29.4,58.25 C9.1 | R10.1 4.76,12.75 v4.72,12.7 | U$7.4 13.58,21.15 v13.44,21.29
  Top 0.203: CN1.4 14.25,43.46 15.33,44.54 15.7,44.54 16.2,45.05 16.2,47.7 v16.7,48.2 | v34,1.75 33.62,1.38 9.75,1.38 8.75,2.38 8.75,5.62 7.75,6.62 4.25,6.62 3.25,7.62 3.25,10.25 3.77,10.77 C28.1 | U$3.30 26.26,58.25 25.95,58.56 25.95,61.51 26.19,61.75 U$3.37 28.73,61.75 v29.1,62.12 | U$3.2 14.25,51.64 v13.86,51.25 | C13.1 8.11,61.25 v8.68,61.81 9.19,61.81 10.62,63.25 | CN1.18 21.25,38 v21,37.75 20.75,38 CN1.17 | R11.2 35.35,37.85 35.75,38.25 37.34,38.25 CN2.2 | U$3.62 20.25,67.62 v20.77,67.1 | 21.25,51.02 arc90 v21.27,51 22,51.73 22,52.5 21.25,53.25 U$3.16 | R17.2 3.77,77.15 3.5,76.88 3.5,73.5 3.85,73.15 R16.2 4.5,70.25 6.62,68.12 7.65,68.12 v7.66,68.11 | CN4.5 24.5,17.12 22,19.62 C20.1
  Top 0.254: U$3.46 26.12,66.25 25.44,65.57 23.41,65.57 22.8,66.18 22.8,67.1 | 22.8,67.1 22.8,67.4 23.75,68.35 U$3.55 | v7.05,23.73 8.27,22.51 8.27,21.54 8.07,21.34 7.05,21.34 5.02,23.37 v4.11,23.37 | v21.27,51 21.27,47.14 25.75,42.66 CN1.27 25.75,39.97 26.74,38.98 C17.1 27.39,37.98 27.68,37.68 27.68,34.2 26.75,33.27 22.48,33.27 v21.25,34.4 | v20.77,67.1 22.8,67.1 | U$7.4 20.4,21.15 21.15,21.9 C20.1
  Top 0.305: v29.1,62.12 30.15,62.12 C10.2
  Top 0.406: v7.66,68.11 8.07,68.52 8.07,71.26 10.3,73.5 10.3,80.1 7.76,82.64 7.76,86.16 C21.1 7.9,86.3 v11.22,86.3 14.57,82.95 28.49,82.95 v29.61,84.06 29.61,85.71 C22.1
  Top 0.508: C28.1 4.72,10.79 v4.72,12.7
  Top 1.016: v21.25,34.4 19.6,32.75 CN3.1
  Bottom 0.178: v4.72,12.7 4.75,12.74 | 4.56,17.38 4.75,17.56 U$2.10 | v4.11,23.37 4.75,22.73 U$2.1 | U$15.5 13.21,21.05 v13.44,21.29
  Bottom 0.203: U$15.5 12.22,21.05 | U$9.1 31.25,3.5 33,1.75 v34,1.75 | v21.27,51 19.71,51 18.43,49.72 17.82,49.72 16.3,51.25 v13.86,51.25 15.28,49.83 C18.2 16.24,48.67 v16.7,48.2 | v8.68,61.81 8.17,61.31 2.68,61.31 2.75,61.24 | CN2.2 35.3,40.25 35.3,45.65 32.75,48.2 26.66,48.2 26.15,48.71 26.15,49.47 | v21,37.75 21.25,38
  Bottom 0.254: 12.22,21.05 10.71,22.56 10.71,23.47 10.2,23.98 9.39,23.98 8.98,24.39 8.98,24.79 8.68,25.1 7.46,25.1 7.05,24.69 v7.05,23.73 | CN7.2 8.3,68.75 v7.66,68.11 | 2.58,65.98 2.68,61.31 | CN8.2 12.75,84.77 v11.22,86.3 | 29.62,84.05 v29.61,84.06 | v20.77,67.1 20.65,67.1 19.25,68.5 C12.2
  Bottom 0.305: CN9.2 29.62,84.05
  Bottom 0.406: 2.75,32.75 2.75,23.25 2.87,23.37 v4.11,23.37 | v7.66,68.11 5.53,65.98 2.58,65.98 | CN6.2 26.75,62.12 | 26.75,62.12 v29.1,62.12 29.1,58.56 28.19,57.65 28.19,54.7 29.4,53.48 29.4,51.15 27.73,49.47 26.15,49.47 24.68,49.47 23.27,50.88 22.63,50.88 C8.2 | 26.75,62.12 26.75,62.84 26.05,63.54 25.24,63.54 21.68,67.1 v20.77,67.1 20.77,70.7 27.73,77.66 27.73,83.4 28.39,84.06 v29.61,84.06 | U$12.23 23.65,32 v21.25,34.4 | v21.27,51 21.25,50.77 21.25,50.75 21.5,50.75
  Bottom 0.508: 4.75,12.74 4.56,12.93 4.56,17.38 | 19.75,37.94 20.16,38.34 21.28,38.34 21.25,38.37 21.25,38.5 L1.2
  Bottom 1.016: v21.25,34.4 21.25,38 21.25,38.5
  Bottom 1.27: CN3.1 2.75,32.75
  pour Bottom: 4.75,19.25 4.75,16 0.25,16 0.25,53.5 2.25,55.5 2.25,66.13 3.25,66.13 3.25,53.5 3,53.25 3,23.75 5,23.75 5,21.5 3,21.5 3,19.25
  pour Bottom: 25.88,37.25 25.88,41.12 19.12,41.12 19.12,37.25
5V  (via drill 0.33)
  Top 0.203: v28.15,12.91 28.15,12.34 26.32,10.5 R6.2
  Bottom 0.203: U$9.19 28.75,11.78 28.15,12.38 v28.15,12.91
  other vias: 24.25,6.1 23.33,6.1 18.45,13.11 18.45,12.13
  pour Bottom: 20.87,6.4 24.55,6.4 24.55,3.97 20.87,3.97
  pour Bottom: 17.03,14.27 17.03,11.78 19.78,11.78 19.78,14.27
  pour Top: 27.9,2.83 25.01,2.83 24.65,3.19 24.65,8.58 25.36,9.29 25.36,10.76 24.35,10.76 24.35,9.59 23.74,8.98 22.42,8.98 19.67,11.73 19.67,13.62 17.44,13.62 17.44,10.16 19.57,8.03 21.4,8.03 21.91,7.52 21.91,6.34 19.88,4.56 19.06,4.56 19.06,3.65 19.98,3.65 21.81,1.82 27.9,1.82
13V  (via drill 0.33)
  Top 0.203: CN1.2 13.25,40.25 v12.5,39.5
  Bottom 0.203: v12.5,39.5 C19.1
  pour Bottom: 31.38,40.62 31.38,45.5 25.75,45.5 24.88,44.62 23.62,44.62 23,45.25 23,47 18.75,47 18.75,44 14.75,44 13.25,42.5 13.25,37.75 12,37.75 12,42.5 14.25,44.75 18,44.75 18,47.25 32.25,47.25 32.88,46.62 32.88,40.62
AN0  (via drill 0.33)
  Top 0.178: U$3.25 25.75,52.88 26.12,52.5 28.25,52.5 28.75,52.5 31.75,55.5 34.5,58.25 34.5,68.16 30.7,71.95 30.7,78.75 v32,80.25
  Bottom 0.178: v32,80.25 31.5,80.75 CN9.4
AN1  (via drill 0.33)
  Top 0.178: U$3.24 25.25,52.75 26,52 28.38,52 28.88,52 32.12,55.25 34.88,58 34.88,68.33 31.1,72.1 31.1,77.75 v32,78.75
  Bottom 0.178: v32,78.75 CN9.6
AN2  (via drill 0.33)
  Top 0.178: U$3.23 24.75,52.62 25.88,51.5 28.5,51.5 29,51.5 32.5,55 35.25,57.75 35.25,68.5 31.5,72.25 31.5,76.25 v32,76.75
  Bottom 0.178: v32,76.75 CN9.8
AN3  (via drill 0.33)
  Top 0.178: U$3.22 24.25,59.25 v24.75,59.75
  Bottom 0.178: v24.75,59.75 CN6.4
AN4  (via drill 0.33)
  Top 0.178: U$3.21 23.75,58.75 v22.75,59.75
  Bottom 0.178: v22.75,59.75 CN6.6
AN5  (via drill 0.33)
  Top 0.178: U$3.20 23.25,57.86 v21.36,59.75
  Bottom 0.178: v21.36,59.75 CN6.8
AN8  (via drill 0.33)
  Top 0.178: U$3.32 33.29,59.25 v33.57,58.97 | v30.32,49.62 30.72,49.22 30.72,38.75 28.49,36.52 28.49,30.59 25.5,27.59 CN4.2
  Bottom 0.178: v33.57,58.97 33.57,58.16 32.86,57.45 29.51,57.45 29.1,57.04 29.1,55.21 30.32,53.99 v30.32,49.62
AN9  (via drill 0.33)
  Top 0.178: U$3.33 33.75,59.75 34.12,60.12 34.12,67.93 30.31,71.75 30.31,80.93 28.8,82.44 15.44,82.44 14.75,81.75 v14.75,81
  Bottom 0.178: v14.75,81 CN8.4
AN10  (via drill 0.33)
  Top 0.178: U$3.34 33.38,60.25 33.75,60.62 33.75,67.71 29.91,71.56 29.91,80.66 28.57,82 17.25,82 16.75,81.5 v16.75,81
  Bottom 0.178: CN8.6 v16.75,81
AN11  (via drill 0.33)
  Top 0.178: U$3.35 33.12,60.75 33.38,61 33.38,67.49 29.51,71.36 29.51,80.41 28.42,81.5 19.25,81.5 v18.75,81
  Bottom 0.178: v18.75,81 CN8.8
AN12  (via drill 0.33)
  Top 0.178: U$3.41 32.34,63.75 v32.66,63.44 | v29.2,49.62 30.32,48.5 30.32,38.95 28.08,36.72 28.08,30.89 25,27.81 CN4.4
  Bottom 0.178: v32.66,63.44 32.66,58.36 32.15,57.85 29.3,57.85 28.69,57.24 28.69,55.01 29.91,53.79 29.91,50.33 v29.2,49.62
AN13  (via drill 0.33)
  Top 0.178: U$3.42 32.55,64.25 32.96,64.66 32.96,67.3 29.1,71.16 29.1,80.07 28.17,81 19.75,81 18.75,80 14.99,80 13.99,79 13.99,75.33 v13.18,74.52
  Bottom 0.178: CN7.8 12.94,74.75 v13.18,74.52
AN14  (via drill 0.33)
  Top 0.178: U$3.43 32.24,64.75 32.55,65.06 32.55,67.1 28.69,70.96 28.69,79.73 27.92,80.5 20,80.5 19,79.5 15.24,79.5 14.44,78.69 14.44,74.52 v12.98,73.06
  Bottom 0.178: CN7.6 12.66,72.75 v12.98,73.06
AN15  (via drill 0.33)
  Top 0.178: U$3.44 31.93,65.25 32.15,65.47 32.15,66.89 28.29,70.75 28.29,79.39 27.67,80 20.25,80 19.25,79 15.34,79 14.84,78.5 14.84,73.87 13.15,72.19 13.15,71.58 v12.37,70.8
  Bottom 0.178: CN7.4 12.32,70.75 v12.37,70.8
CC3000_OUT
  Bottom 0.178: U$15.2 10.5,22 11,21.5 11,20.5 11.5,20 13.41,20 14.27,20.86 14.27,21.89 14.83,22.45 U$12.13
CHARGE_SENSE
  Top 0.178: D1.ANODE 19.38,2.78 R13.1
D0
  Top 0.178: CN1.14 19.25,38.5 15.89,35.14 10.45,35.14 7.59,38 7.59,54.16 6.24,55.52 6.24,58.97 6.65,59.38 8.68,59.38 9.05,59.75 U$3.93
D1
  Top 0.178: CN1.13 18.75,38.61 15.69,35.55 10.66,35.55 8,38.2 8,54.36 6.65,55.72 6.65,58.77 6.85,58.97 8.98,58.97 9.26,59.25 U$3.94
D2
  Top 0.178: U$3.98 10.77,57.25 9.69,56.17 9.69,49.83 8.41,48.54 8.41,38.41 10.86,35.96 15.48,35.96 18.25,38.72 CN1.12
D3
  Top 0.178: U$3.99 10.93,56.75 10.1,55.92 10.1,49.62 8.81,48.34 8.81,38.61 11.06,36.36 15.28,36.36 17.75,38.83 CN1.11
D4
  Top 0.178: U$3.100 11.09,56.25 10.51,55.67 10.51,49.42 9.22,48.13 9.22,38.81 11.27,36.77 15.08,36.77 17.25,38.94 CN1.10
D5
  Top 0.178: U$3.3 14.75,49.8 12.95,48 9.94,48 9.63,47.68 9.63,39.02 11.47,37.18 14.88,37.18 16.75,39.05 CN1.9
D6
  Top 0.178: 13.4,47.59 12.53,46.73 12.53,44.78 10.1,42.6 10.1,39.4 11.92,37.58 14.67,37.58 16.25,39.16 CN1.8
  Top 0.203: 13.4,47.59 15.25,49.44 U$3.4
D7
  Top 0.178: 13.6,47.18 12.94,46.52 12.94,44.59 10.5,42.4 10.5,39.61 12.12,37.99 14.47,37.99 15.75,39.27 CN1.7
  Top 0.203: 13.6,47.18 15.75,49.33 U$3.5
EN_REG  (via drill 0.33)
  Top 0.178: v33.84,12.29 34.7,12.29 36.23,10.76 36.23,7.02 34.75,5.55 34.75,1.5 34.16,0.91 7.59,0.91 7.25,1.25 R36.2 6.35,2.15 2.75,5.75 2.75,16.75 3.25,17.25 v7.25,17.25
  Bottom 0.178: v7.25,17.25 6.75,17.75 U$2.6
  Bottom 0.254: U$5.O 33.87,12.25 v33.84,12.29
GND  (via drill 0.33)  (1 unrouted)
  Bottom 0.178: U$2.9 5.25,19.75 U$2.TH3 | U$2.3 U$2.TH4
  Bottom 0.203: U$9.17 27.75,10.21 29.22,8.74 29.25,8.77
  Bottom 0.254: 29.76,5.77 29.76,8.26 29.25,8.77 U$9.20
  other vias: 11.75,3.5 13,3.5 13,2.25 11.75,2.25 7.75,10.5 9,10.5 7.75,9.25 9,9.25 30.19,22.43 29.89,21.26 30.24,20.04 33,32.25 34,32.25 35,32.25 36,32.25 37,32.25 38,32.25 33.75,17.5 34.75,17.5 35.75,17.5 36.75,17.5 37.75,17.5 23.92,34.08 14.06,38.65 13.66,45.25 12.95,50.33 27.22,53.38 31.79,63.08 6.37,62.33 8.27,24.39 19.75,75.38 21.68,68.01 2.99,89.91 36.52,90.01 33.25,85.69 6.15,84.6 4.75,5.12 20.51,49.26 24,76.62 24.93,50.64 3.6,67.4 25.29,64.61 28.39,48.91 36,19.25 36,21.25 36,23.25 36,25 36,26.75 38,30.25 37,30.25 36,30.25 35,31.25 34,31.25 16.5,65.5 17,46.5 30,13.75 18.75,34.25 26.06,32.48 22.5,25.12 30.5,35 12.75,31 24.25,48.62
  pour Bottom (rank 4): 39.25,0.25 0.25,0.25 0.25,53.25 2.25,55.25 2.25,90.75 37.25,90.75 37.25,55.25 39.25,53.25 39.25,29.5 33.25,29.5 33.25,18.25 35.5,18.25 35.5,27.5 36.5,27.5 36.5,18.25 39.25,18.25
  pour Top (rank 4): 39.25,0.25 0.25,0.25 0.25,53.25 2.25,55.25 2.25,90.75 37.25,90.75 37.25,55.25 39.25,53.25 39.25,27.5 31.75,27.5 31.75,16.25 35.5,16.25 35.5,25.5 36.5,25.5 36.5,16.25 39.25,16.25
IO2/CC3000_INT  (via drill 0.33)
  Top 0.178: U$3.18 22.25,53.73 v23.51,52.47
  Bottom 0.178: 12.34,23.78 11.93,24.18 11.93,24.79 11.32,25.4 11.32,28.66 10.1,29.87 10.1,49.83 13.25,52.98 17.11,52.98 18.13,51.96 19.54,51.96 19.75,51.75 20.75,51.75 21,52 23.05,52 v23.51,52.47
  Bottom 0.203: 12.34,23.78 14.3,23.78 14.43,23.65 U$12.14
IO4  (via drill 0.33)
  Top 0.178: U$3.74 14.25,72.57 15.28,73.6 15.28,78.27 15.59,78.58 20.06,78.58 v20.77,79.29
  Bottom 0.178: v20.77,79.29 20.77,83.11 CN8.10
IO5  (via drill 0.33)
  Top 0.178: U$3.76 11,68.25 10.75,68.5 10.75,70.95 11.93,72.13 11.93,75.02 13.15,76.24 13.15,79.6 v12,80.75
  Bottom 0.178: v12,80.75 CN7.14
IO6  (via drill 0.33)
  Top 0.178: U$3.77 10.75,67.75 10.25,68.25 10.25,71.1 11.53,72.38 11.53,75.23 12.75,76.45 12.75,78 v12,78.75
  Bottom 0.178: v12,78.75 CN7.12
IO7/RAD_SIG1  (via drill 0.33)
  Top 0.178: U$3.19 22.75,57.7 21.48,58.97 21.07,58.97 20.46,59.58 20.46,60.59 21.28,61.41 v21.28,65.06
  Bottom 0.178: v21.28,65.06 20.97,64.76 15.08,64.76 14.88,64.56 12.13,64.56 10.51,62.93 10.51,59.38 8.58,57.45 6.75,57.45 5.97,56.66 5.97,47.97 5.5,47.5 3.5,47.5 2.9,46.9 2.9,36.65 CN3.2
IO8  (via drill 0.33)
  Top 0.178: U$3.79 10.5,66.75 9.75,67.5 9.75,71.32 11.12,72.69 11.12,75.87 v12,76.75
  Bottom 0.178: v12,76.75 CN7.10
IO9/AUDIO  (via drill 0.33)
  Top 0.178: U$3.78 v13.75,67.25 | v8.27,66.89 8.17,66.79 5.02,66.79 3.7,65.47 3.7,53.08 5.75,51.03 5.75,46.2 CN3.6
  Bottom 0.178: v13.75,67.25 8.63,67.25 v8.27,66.89
IO22/OLED_REG
  Top 0.203: CN1.20 22.25,43.75 16.75,49.25 U$3.7
IO23/OLED_RESET
  Top 0.203: CN1.21 22.75,44 17.25,49.5 U$3.8
IO25  (via drill 0.33)
  Top 0.178: U$3.51 26.16,69.85 v26.66,70.35
  Bottom 0.178: v26.66,70.35 26.66,69.43 27.27,68.82 29.55,68.82 CN9.16
IO26  (via drill 0.33)
  Top 0.178: U$3.56 23.25,71 23.82,71.57 v26.66,71.57
  Bottom 0.178: v26.66,71.57 26.76,71.57 27.58,70.75 CN9.14
IO27  (via drill 0.33)
  Top 0.178: U$3.57 22.75,71.11 23.72,72.08 25.95,72.08 v26.66,72.79
  Bottom 0.178: v26.66,72.79 29.59,72.79 CN9.12
IO28/OLED_BOOST_EN  (via drill 0.33)
  Top 0.178: U$3.1 12.69,54.65 v11.93,53.89 | v27.07,50.74 27.37,51.04 31.03,51.04 31.54,50.54 31.54,37.12 30.72,36.31 v30.12,36.31
  Bottom 0.178: U$24.4 28.12,40.25 28.62,39.75 28.62,38.12 29.25,37.5 R14.2 30.12,37.47 v30.12,36.31 | v11.93,53.89 12.23,54.19 23.61,54.19 v27.07,50.74
IO45  (via drill 0.33)
  Top 0.178: U$3.87 13.15,62.75 v14.25,63.85
  Bottom 0.178: v14.25,63.85 13.6,63.85 12.75,63 CN6.16
IO46  (via drill 0.33)
  Top 0.178: U$3.88 14.15,62.25 v15,63.1
  Bottom 0.203: v15,63.1 15,61.85 CN6.14
IO47  (via drill 0.33)
  Top 0.178: U$3.83 13.25,64.75 14.4,65.9 14.4,67.5 11.49,70.41 11.49,71.05 12.33,71.88 12.33,74.71 13.55,75.94 13.55,80.2 9.75,84 v9.75,84.5
  Bottom 0.178: v9.75,84.5 9.75,82.88 CN7.16
IO48  (via drill 0.33)
  Top 0.178: U$3.68 17.25,71.83 16.09,72.99 16.09,77.46 16.4,77.77 24.22,77.77 v24.73,78.27
  Bottom 0.178: v24.73,78.27 24.75,78.29 CN8.14
IO53/CC3000_CS  (via drill 0.33)
  Top 0.178: U$3.14 20.25,52.66 v20.36,52.55 | v10.2,19.41 10.2,24.39 v9.8,24.79
  Bottom 0.178: v20.36,52.55 19.12,53.79 12.84,53.79 9.29,50.23 9.29,29.47 10.51,28.25 10.51,25.5 v9.8,24.79 | U$15.1 9.75,19.86 v10.2,19.41 13.52,19.41 15.36,21.25 U$12.12
IO70/CC3000_EN  (via drill 0.33)
  Top 0.178: U$3.17 21.78,54.62 21.78,53.58 22.7,52.67 22.7,52.16 23.11,51.76 24.93,51.76 26.66,50.03 27.37,50.03 27.98,50.64 30.42,50.64 31.13,49.93 31.13,38.55 29.2,36.62 v29.2,35.3
  Bottom 0.178: v29.2,35.3 29.16,35.25 R19.2 25.75,35.1
  Bottom 0.254: U$12.26 27.25,32.75 25.6,34.4 R19.2
IO72  (via drill 0.33)
  Top 0.178: U$3.60 21.25,71.03 21.68,71.47 22.5,71.47 23.51,72.48 25.24,72.48 26.66,73.9 v26.66,74.72
  Bottom 0.178: v26.66,74.72 29.59,74.72 CN9.10
IO73  (via drill 0.33)
  Top 0.178: U$3.61 20.75,71.24 21.38,71.87 22.29,71.87 23.31,72.89 25.14,72.89 25.95,73.7 v25.95,77.36
  Bottom 0.178: v25.95,77.36 26.97,78.38 26.97,80 26.75,80.22 CN8.16
IO75  (via drill 0.33)
  Top 0.178: U$3.73 14.75,72.46 15.69,73.4 15.69,77.87 15.99,78.17 21.58,78.17 v22.7,79.29
  Bottom 0.178: v22.7,79.29 22.75,79.34 CN8.12
IO80  (via drill 0.33)
  Top 0.178: U$3.91 14.4,60.75 v16.75,63.1
  Bottom 0.178: v16.75,63.1 CN6.12
IO81  (via drill 0.33)
  Top 0.178: U$3.92 15.25,60.25 18.1,63.1 v18.75,63.1
  Bottom 0.178: v18.75,63.1 CN6.10
IO82/TOUCH_INT  (via drill 0.33)
  Top 0.178: U$3.95 9.48,58.75 9.29,58.56 7.76,58.56 7.36,58.16 v7.36,56.23 | v6.9,28.55 23.86,28.55 24.5,27.92 CN4.6
  Bottom 0.178: v7.36,56.23 7.36,55.21 8.17,54.4 8.17,52.26 7.26,51.35 7.26,28.91 v6.9,28.55
IO83/SD_CDET  (via drill 0.33)
  Top 0.178: U$3.96 9.69,58.25 9.49,58.05 8.78,58.05 8.07,57.34 v8.07,55.52 | v6.34,29.58 6.06,29.3 6.06,25.68 8.76,22.99 8.76,19.08 8.35,18.68 U$7.10 8.35,12.8 R10.2
  Bottom 0.178: v8.07,55.52 8.58,55.01 8.58,52.06 7.66,51.15 7.66,28.12 7.26,27.72 6.06,27.72 5.63,28.15 5.63,28.97 6.24,29.58 v6.34,29.58
IO84/CS_SD  (via drill 0.33)
  Top 0.178: U$3.97 9.9,57.75 v8.78,56.63 | U$7.2 16.62,23.35 16.09,23.88 16.09,27.03 15.79,27.33 11.12,27.33 10.2,26.42 v9.69,26.42
  Bottom 0.178: v8.78,56.63 8.78,55.52 8.98,55.31 8.98,51.86 8.07,50.94 8.07,27.54 8.48,27.13 9.49,27.13 9.69,26.93 v9.69,26.42
MCLR#  (via drill 0.33)
  Top 0.178: 31.84,33.9 30.17,32.23 30.17,23.48 28.88,22.18 28.88,18.12 31.99,15.01 SJ1.2 | U$3.13 19.75,53.48 19.65,53.38 19.65,48.2 v19.75,48.1
  Top 0.203: 31.84,33.9 33,35.06 33,35.75 33.4,36.15 R11.1 35.35,36.15 35.75,35.75 37.04,35.75 CN2.1 | SJ1.2
  Bottom 0.178: v19.75,48.1 20.06,47.79 32.45,47.79 34.87,45.38 34.87,37.7 37.12,35.69 CN2.1
N$1
  Bottom 0.203: U$2.4 6.25,25.75 arc-90 6.75,26.25 L3.1
N$2
  Bottom 0.203: U$2.2 5.25,25.75 arc90 4.75,26.25 L3.2
N$3
  Bottom 0.254: U$9.15 25,9.5 arc90 24.55,9.05 arc-90 24.04,8.54 22.72,8.54 arc90 22.31,8.13 arc90 22.72,7.72 23.64,7.72 arc-90 24.04,7.32 arc-90 23.64,6.91 20.87,6.91 arc90 20.4,6.44 U$8.2
N$4
  Bottom 0.254: U$8.3 19.75,3.87 arc90 20.26,3.36 24.45,3.36 arc90 25.06,3.97 25.06,8.34 arc-90 25.72,9 U$9.14
N$5  (via drill 0.33)
  Top 0.178: v30.75,12 27.5,8.75 R1.1
  Bottom 0.178: U$9.22 30.25,11.5 v30.75,12
N$6  (via drill 0.33)
  Top 0.178: R2.1 25.5,8.25 26.25,8.25 26.5,8.5 26.5,9.25 v29.35,12.1
  Bottom 0.178: U$9.21 29.75,11.7 v29.35,12.1
N$7
  Top 0.178: D4.CATHODE R1.2
N$8
  Top 0.178: D5.CATHODE R2.2
N$9  (via drill 0.33)
  Top 0.178: v33,5 C3.1
  Bottom 0.178: U$9.31 32.75,7 33,6.75 v33,5
N$10  (via drill 0.33)
  Top 0.178: v33,3 R3.1
  Bottom 0.178: v33,3 32,4 U$9.32
N$11
  Top 0.178: C3.2 30.15,4 | 30.15,4 R3.2 | 30.15,4 33.25,4 33.75,4.5 33.75,6 34.5,6.75 34.5,9.75 33,11.25
  Top 0.203: 33,11.25 33,12.75 33.75,13.5 SJ1.1
N$12  (via drill 0.33)
  Top 0.178: v26,11.75 25.25,11.75 24.9,12.1 C4.1 R7.2 22.85,10.8 R6.1
  Bottom 0.178: U$9.18 28.25,11.5 27.75,12 26.25,12 v26,11.75
N$13  (via drill 0.33)
  Top 0.178: v29,4.25 29,8.75 29.25,9 R5.1
  Bottom 0.178: U$9.2 30.75,4.75 30.25,4.25 v29,4.25
N$14
  Bottom 0.635: L6.2 C31.1 U$6.1
N$15  (via drill 0.33)
  Top 0.178: v33.25,8 30.5,8 30.15,7.65 R4.1
  Bottom 0.178: U$9.30 32.75,7.5 v33.25,8
N$16
  Bottom 0.178: U$12.27 28.45,32.26 28.77,32.59 29.28,32.59 29.65,32.21 U$12.28
N$17  (via drill 2)  (3 unrouted)
  other vias: 3,50.25 36.5,50.25 2.25,2.75 37.25,2.75
N$18
  Bottom 0.635: U$12.35 L6.1
N$19
  Top 0.178: U$3.85 C7.A
N$20  (via drill 0.33)
  Top 0.203: CN1.3 13.75,43.77 v15.28,45.3
  Bottom 0.203: v15.28,45.3 15.28,46.24 C15.1
N$21
  pour Bottom: 25.75,41.88 19.12,41.88 19.12,46.6 22.5,46.6 22.5,45.12 23.88,43.75 25.75,43.75
N$22
  Top 0.203: CN1.22 23.25,39.91 22.72,39.38 R15.2
N$23
  pour Bottom: 27.12,41.88 29.12,41.88 29.12,38.75 30.62,38.75 30.62,44.38 29.12,44.38 29.12,43.75 27.12,43.75
N$24
  Top 0.203: CN1.26 25.25,39.88 24.72,39.35 C16.1
N$25
  Bottom 0.203: D10.2 D9.1
N$26
  Bottom 0.203: D9.2 17.25,42.23 R18.1
N$27
  Bottom 0.305: U1.5 21.5,12.85 R12.2
N$28
  Bottom 0.203: U$12.30 arc-90 32,27.3 32.94,27.3 arc90 33.34,27.71 33.34,27.91 arc90 32.83,28.42 31.98,28.42 arc-90 U$12.29
N$29  (via drill 0.33)
  Top 0.203: CN1.5 14.75,42.89 v15.54,43.68
  Bottom 0.203: v15.54,43.68 15.54,42.46 R18.2
N$32  (via drill 0.33)
  Top 0.254: v21.45,8.07 19.57,8.07 17.5,6 D1.CATHODE
  Bottom 0.254: U1.1 21.45,8.32 v21.45,8.07
N$33
  Bottom 0.203: U$12.5 24.85,19.4 24.5,19.75 22.75,19.75 22.45,19.45 U$12.7
NCS1  (via drill 0.33)
  Top 0.178: CN1.19 21.75,39.29 21.83,39.21 21.83,36.23 21.25,35.64 18.22,35.64 16.5,33.92 9.85,33.92 6.39,37.38 6.39,51.09 4.11,53.38 4.11,65.27 5.02,66.18 9.08,66.18 v9.39,66.49 | v15.69,66.49 15.75,66.55 U$3.71
  Bottom 0.178: v9.39,66.49 v15.69,66.49
NRD
  Top 0.178: U$3.82 5.31,65.25 4.92,64.86 4.92,53.79 7.19,51.52 7.19,37.8 10.25,34.74 16.09,34.74 19.75,38.39 CN1.15
NWR
  Top 0.178: U$3.81 5.2,65.75 4.51,65.06 4.51,53.58 6.78,51.31 6.78,37.59 10.05,34.33 16.3,34.33 20.25,38.28 CN1.16
OSC1
  Top 0.178: U$3.63 19.75,73.5 arc-90 20.5,74.25 X1.1 arc-90 21.65,74.35
  Top 0.203: C5.1 22.35,74.85 X1.1
OSC2
  Top 0.178: U$3.64 19.25,73.5 arc90 18.5,74.25 X1.2 arc90 17.35,74.35
  Top 0.203: C6.1 17.25,76.75 X1.2
PGEC2  (via drill 0.33)
  Top 0.178: U$3.26 29.48,56.25 29.81,55.92 v30.62,55.92
  Bottom 0.203: CN2.5 37.12,46.88 36.75,47.25 35.25,47.25 31.5,51 31.5,55.05 v30.62,55.92
PGED2  (via drill 0.33)
  Top 0.178: U$3.27 v30,56.75
  Bottom 0.203: CN2.4 36.21,43.29 35.75,43.75 35.75,46 31,50.75 31,54 29.75,55.25 29.75,56.5 v30,56.75
RG0/RAD_SIG2  (via drill 0.33)
  Top 0.178: U$3.90 9.94,61.25 8.58,59.88 6.44,59.88 5.73,59.17 5.73,54.5 6.14,54.09 v6.65,54.09
  Bottom 0.178: v6.65,54.09 7.36,53.38 7.36,52.77 6.82,52.23 6.82,39.65 CN3.3
RG1/RAD_NS  (via drill 0.33)
  Top 0.178: U$3.89 9.83,61.75 8.37,60.29 6.24,60.29 5.33,59.38 5.33,54.19 6.44,53.08 v6.65,53.08
  Bottom 0.178: v6.65,53.08 6.41,52.84 6.41,41.78 CN3.4
SCL1  (via drill 0.33)
  Top 0.178: v33.5,72 36.25,74.75 36.25,88.5 35.25,89.5 25.75,89.5 v23.25,87 20.75,89.5 4.5,89.5 3.25,88.25 3.25,82 v6,79.25 | U$3.66 18.25,67.53 v18.23,67.5 18.23,66.08 20.46,63.85 20.46,61.92 19.45,60.9 19.45,58.87 19.04,58.46 v16.81,58.46 | v8.78,27.84 9.49,27.13 10.3,27.13 10.91,27.74 22.95,27.74 23.5,27.19 CN4.10
  Top 0.203: R17.1 5.6,78.85 v6,79.25
  Bottom 0.178: CN9.11 34.25,72.75 v33.5,72 | CN8.11 22.75,87.5 v23.25,87 | CN7.11 5.5,78.75 v6,79.25 6.45,79.7 12.44,79.7 12.95,79.19 12.95,78.07 18.23,72.79 v18.23,67.5 | v16.81,58.46 16.75,58.41 CN6.11 16.75,55.36 16.4,55.01 10.2,55.01 9.39,54.19 9.39,51.65 8.48,50.74 8.48,28.15 v8.78,27.84
SDA1  (via drill 0.33)
  Top 0.178: v33.5,75.25 35,75.25 35.75,76 35.75,88.25 35,89 27,89 23,85 21,85 20.25,85.75 v20.25,87 20.25,88.5 19.75,89 4.75,89 3.75,88 3.75,83 8,78.75 8,77 7.25,76.25 v6,76.25 | U$3.67 17.75,68.55 v17.31,68.11 17.31,66.39 20.06,63.64 20.06,62.22 18.74,60.9 v18.74,59.17 | v9.8,27.84 10.1,28.15 23.36,28.15 24,27.5 CN4.8
  Top 0.203: R16.1 4.5,75.75 4.75,76 5.75,76 v6,76.25
  Bottom 0.178: CN9.9 34,74.75 v33.5,75.25 | CN8.9 20.75,87.5 v20.25,87 | CN7.9 5.5,76.75 v6,76.25 6.52,75.73 14.67,75.73 17.82,72.58 17.82,68.42 17.52,68.11 v17.31,68.11 | v18.74,59.17 v18.75,59.16 CN6.9 18.75,54.92 18.43,54.6 10.51,54.6 9.8,53.89 9.8,51.45 8.88,50.54 8.88,28.96 9.8,28.15 v9.8,27.84
SPI2_CLK  (via drill 0.33)
  Top 0.178: v33.5,80.25 34.25,81 34.25,87 33.75,87.5 27.75,87.5 23.75,83.5 17.5,83.5 15.25,85.75 v15.25,87 14.75,87.5 5.75,87.5 5.25,87 5.25,83.75 9.5,79.5 9.5,73.5 7.25,71.25 v6,71.25 | U$3.70 16.25,71.52 v16.3,71.57
  Bottom 0.178: CN9.3 34,80.75 v33.5,80.25 | CN8.3 14.75,87.5 v15.25,87 | CN7.3 5.5,70.75 v6,71.25 7.37,71.25 7.87,70.75 7.87,70.04 8.17,69.74 12.23,69.74 13.25,70.75 15.48,70.75 v16.3,71.57 16.3,70.5 15.74,69.94 15.74,67.55 17.31,65.98 21.48,65.98 23.82,63.64 23.82,58.87 24.75,57.93 CN6.3
SPI2_MISO  (via drill 0.33)
  Top 0.178: v33.5,76.75 34.75,76.75 35.25,77.25 35.25,88 34.75,88.5 27.25,88.5 23.25,84.5 20,84.5 18.75,85.75 v18.75,87 18.75,88 18.25,88.5 5,88.5 4.25,87.75 4.25,83.25 8.5,79 8.5,76 7.25,74.75 v6,74.75 | U$3.9 17.75,56.26 19.91,58.41 v20.77,58.41 19.85,59.33 19.85,60.7 20.87,61.71 20.87,64.05 19.14,65.78 v19.14,67.1
  Bottom 0.178: CN9.7 v33.5,76.75 | CN8.7 v18.75,87 | CN7.7 v6,74.75 6.95,73.8 15.99,73.8 17.42,72.38 17.42,70.25 16.6,69.43 16.6,67.91 17.72,66.79 18.84,66.79 v19.14,67.1 | v20.77,58.41 20.77,56.92 CN6.7
SPI2_MOSI  (via drill 0.33)
  Top 0.178: v33.5,78.75 34.25,78.75 34.75,79.25 34.75,87.5 34.25,88 27.5,88 23.5,84 18.5,84 16.75,85.75 v16.75,87 16.75,87.75 16.5,88 5.25,88 4.75,87.5 4.75,83.5 9,79.25 9,74.5 7.25,72.75 v6,72.75 | U$3.72 15.25,71.84 v15.48,72.18
  Bottom 0.178: CN9.5 v33.5,78.75 | CN8.5 v16.75,87 | CN7.5 v6,72.75 6.98,71.77 15.08,71.77 v15.48,72.18 15.89,72.58 16.6,72.58 17.01,72.18 17.01,70.55 16.2,69.74 16.2,67.71 17.52,66.39 21.68,66.39 25.04,63.03 25.54,63.03 25.75,62.83 25.75,55.72 25.24,55.21 23.11,55.21 22.75,55.56 CN6.5
SPI_CLK  (via drill 0.33)
  Top 0.178: U$3.10 18.25,53.61 17.72,53.08 17.72,50.84 v18.13,50.44 | v13.05,26.52 12.34,26.52 12.03,26.22 12.03,21.04 13.02,20.05 U$7.5
  Bottom 0.178: v18.13,50.44 16.4,52.16 13.66,52.16 10.91,49.42 10.91,30.28 13.05,28.15 v13.05,26.52
  Bottom 0.203: U$12.17 13.78,27.25 v13.05,26.52
SPI_MISO  (via drill 0.33)
  Top 0.178: U$3.11 18.75,52.89 v18.53,52.67
  Top 0.203: U$7.7 13.89,17.85 11.22,20.53 v11.22,24.39
  Bottom 0.178: v18.53,52.67 17.82,53.38 13.05,53.38 9.69,50.03 9.69,29.67 10.91,28.45 10.91,24.69 v11.22,24.39
  Bottom 0.203: v11.22,24.39 11.22,23.27 11.52,22.96 12.23,22.96 U$15.4
SPI_MOSI  (via drill 0.33)
  Top 0.178: U$3.12 19.25,51.66 v18.84,51.25 | v12.74,24.79 15.29,22.25 U$7.3
  Bottom 0.178: v18.84,51.25 18.23,51.25 16.91,52.57 13.45,52.57 10.51,49.62 10.51,30.08 11.73,28.86 11.73,25.81 v12.74,24.79
  Bottom 0.203: U$12.15 12.8,24.85 v12.74,24.79
U1ARX  (via drill 0.33)
  Top 0.178: R4.2 33.78,7 34,7.22 34,9.45 32.58,10.88 32.58,13.57 28.37,17.78 28.37,22.23 29.77,23.63 29.77,32.44 32.4,35.07 32.4,53.66 33.25,54.51 33.25,54.5 36,57.25 36,65.46 v36.31,65.78 | U$3.52 25.25,68.23 24.53,67.5 24.53,67.1 v23.72,66.28
  Bottom 0.178: v36.31,65.78 36.11,65.78 35.5,66.39 32.35,66.39 31.94,65.98 26.86,65.98 26.15,65.27 24.73,65.27 v23.72,66.28
U1ATX  (via drill 0.33)
  Top 0.178: R5.2 31.85,13.68 27.96,17.57 27.96,22.44 29.36,23.84 29.36,32.59 32,35.23 32,53.88 32.88,54.76 32.88,54.75 35.62,57.5 35.62,66.31 v36.11,66.79 | v23.72,67.3 24.75,68.34 U$3.53
  Bottom 0.178: v36.11,66.79 32.05,66.79 31.74,66.49 26.76,66.49 25.95,65.67 24.93,65.67 24.43,66.18 24.43,66.59 v23.72,67.3
U1BRX  (via drill 0.33)
  Top 0.178: U$3.47 25.55,66.75 v25.3,66.5
  Bottom 0.178: v25.3,66.5 26,66.5 26.5,67 31.5,67 33.25,68.75 CN9.15
U1BTX  (via drill 0.33)
  Top 0.178: U$3.48 25.75,67.25 v25.5,67.5
  Bottom 0.178: v25.5,67.5 31.25,67.5 32.75,69 32.75,70 33.5,70.75 CN9.13
U3ARX  (via drill 0.33)
  Top 0.178: U$3.49 28.53,67.75 29.3,68.52 29.3,69.13 27.88,70.55 27.88,77.46 v26.25,79.09
  Bottom 0.178: v26.25,79.09 25.75,79.59 25.75,86.5 26.75,87.51 CN8.15
U3ATX  (via drill 0.33)
  Top 0.178: U$3.50 27.44,68.25 27.47,68.22 27.47,76.85 25.24,79.09 v23.72,79.09
  Bottom 0.178: v23.72,79.09 23.72,86.1 24.73,87.11 24.73,89.36 CN8.13
U3BRX  (via drill 0.33)
  Top 0.178: U$3.40 23.19,63.25 v23,63.44
  Bottom 0.178: v23,63.44 22.19,64.25 16.7,64.25 15.79,63.34 15.79,60.49 14.47,59.17 13.35,59.17 12.74,58.56 CN6.15
U3BTX  (via drill 0.33)
  Top 0.178: U$3.39 22.68,62.75 v21.99,63.44
  Bottom 0.178: v21.99,63.44 21.63,63.8 18.18,63.8 17.72,63.34 17.72,59.98 17.11,59.38 16.09,59.38 14.75,58.03 CN6.13
VBAT
  pour Bottom: 19.78,11.27 19.78,9.08 18.71,9.08 18.41,8.03 18.31,8.03 18.31,6.95 16.93,5.58 11.87,5.58 11.44,6 8.7,6 8.5,5.79 8.5,0.92 8.29,0.71 6.77,0.71 6.57,0.92 6.57,6.3 7.28,7.01 11.85,7.01 13.26,7.6 16.93,7.6 16.93,9.59 18.61,11.27
VIN  (via drill 0.33)
  Top 0.178: 15,2.58 15.77,1.82 32.97,1.82 34.25,3.1 34.25,5.75 35.26,6.76 v35.26,10.41
  Top 0.203: 15,2.58 15,9.25 v12,12.25 | v12.25,15.5 13,16.25 15.5,16.25 17,14.75 20,14.75 20.5,14.25 24.75,14.25 25,14.5 CN4.3
  Top 0.508: 13.77,29.77 v13.75,29.75
  Top 0.61: v13.75,29.75 7.65,29.75 6.95,30.45 5.94,30.45 5.33,29.84 5.33,24.18 7.45,22.05 v7.56,22.05
  Bottom 0.178: 6.85,21.75 7.16,21.75 v7.56,22.05
  Bottom 0.203: v12,12.25 D2.CATHODE | U$2.7 6.25,16.75 6.5,16.5 7.75,16.5 8.25,17 8.25,19 8.75,19.5 8.75,21.25 8.25,21.75 | 6.85,21.75 U$2.5
  Bottom 0.254: U$5.P 35.25,10.39 v35.26,10.41 | v12.25,15.5 12.25,13 13,12.25
  Bottom 0.508: 13.75,32.67 C30.2 13.83,32.75
  Bottom 0.61: v13.75,29.75 13.75,32.67 | 13.83,32.75 18.25,32.75 18.85,32.15 U$12.19
  pour Bottom: 5.75,19.12 5.75,15.88 7.75,13.88 8.88,13.88 11.25,11.5 13.12,11.5 13.12,8.38 16.25,8.38 16.25,13.88 15.88,13.88 12.48,17.11 11.22,17.09 10.26,17.06 8.98,18.49 9,20.5 9,22.12 8.38,22.75 6.62,22.75 6.62,21.38 8,21.38 8.25,21.12 8.25,19.38 8,19.12

### Text on the board
bPlace: Arducorder | Mini | rev1 | OSH | make | share | dream | give